# Altium project Argon_RevB_PCBA.PrjPcb (part 1 of 2)
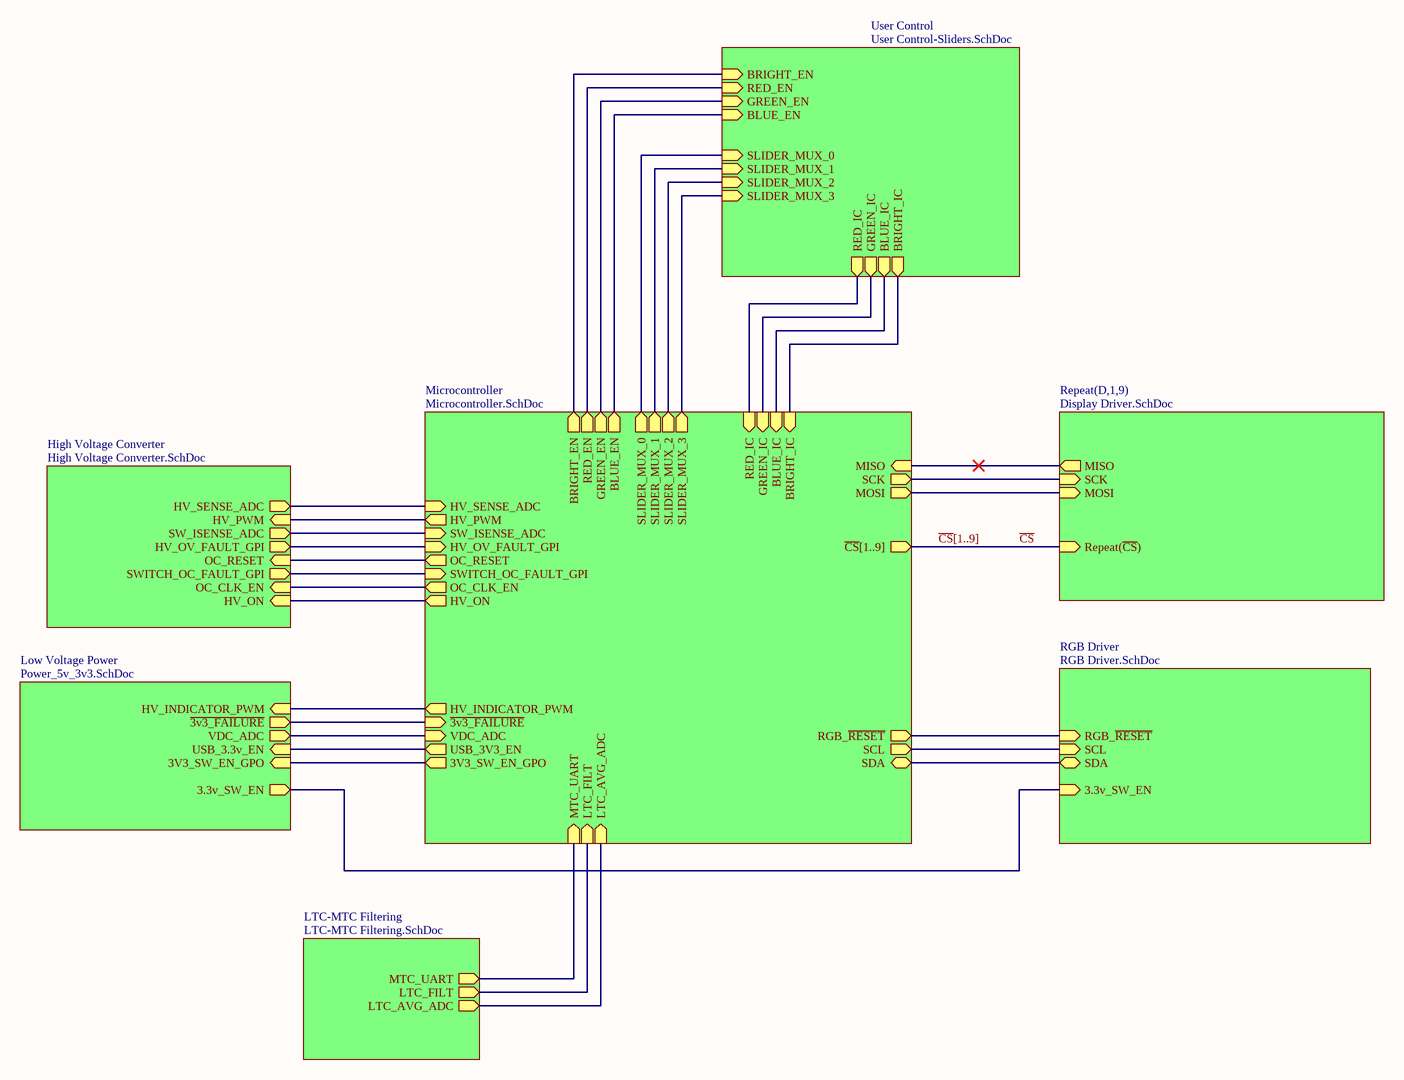
[diagram p0: Heirarchy.SchDoc]
8 sheets, 721 parts. Net scope: hierarchical (ports join the sheet entries above them; power ports are global).
Board file: Argon_RevB_PCB.PcbDoc
Sheets:
  Heirarchy.SchDoc
    Microcontroller = Microcontroller.SchDoc
    Low Voltage Power = Power_5v_3v3.SchDoc
    High Voltage Converter = High Voltage Converter.SchDoc
    D1 = Display Driver.SchDoc
    D2 = Display Driver.SchDoc
    D3 = Display Driver.SchDoc
    D4 = Display Driver.SchDoc
    D5 = Display Driver.SchDoc
    D6 = Display Driver.SchDoc
    D7 = Display Driver.SchDoc
    D8 = Display Driver.SchDoc
    D9 = Display Driver.SchDoc
    RGB Driver = RGB Driver.SchDoc
    LTC-MTC Filtering = LTC-MTC Filtering.SchDoc
    User Control = User Control-Sliders.SchDoc

## Sheet Heirarchy.SchDoc
size D

### Sub-sheets
High Voltage Converter = High Voltage Converter.SchDoc: HV_SENSE_ADC (out), HV_PWM (in), SW_ISENSE_ADC (out), HV_OV_FAULT_GPI (out), OC_RESET (in), SWITCH_OC_FAULT_GPI (out), OC_CLK_EN (in), HV_ON (in)
Low Voltage Power = Power_5v_3v3.SchDoc: HV_INDICATOR_PWM (in), ~{3v3_FAILURE} (out), VDC_ADC (out), USB_3.3v_EN (in), 3V3_SW_EN_GPO (in), 3.3v_SW_EN (out)
LTC-MTC Filtering = LTC-MTC Filtering.SchDoc: LTC_FILT (out), MTC_UART (out), LTC_AVG_ADC (out)
Microcontroller = Microcontroller.SchDoc: HV_PWM (out), SW_ISENSE_ADC (in), HV_INDICATOR_PWM (out), HV_OV_FAULT_GPI (in), VDC_ADC (in), HV_SENSE_ADC (in), ~{3v3_FAILURE} (in), ~{CS}[1..9] (out), USB_3V3_EN (out), RGB_~{RESET} (out), SCL (out), SDA (bidir), 3V3_SW_EN_GPO (out), MISO (in), MOSI (out), SCK (out), MTC_UART (in), LTC_FILT (in), LTC_AVG_ADC (in), BRIGHT_EN (out), RED_EN (out), BLUE_EN (out), GREEN_EN (out), SLIDER_MUX_0 (out), SLIDER_MUX_1 (out), SLIDER_MUX_2 (out), SLIDER_MUX_3 (out), RED_IC (in), BLUE_IC (in), BRIGHT_IC (in), GREEN_IC (in), OC_RESET (out), SWITCH_OC_FAULT_GPI (in), OC_CLK_EN (out), HV_ON (out)
Repeat(D,1,9) = Display Driver.SchDoc: Repeat(~{CS}) (in), MISO (out), SCK (in), MOSI (in)
RGB Driver = RGB Driver.SchDoc: RGB_~{RESET} (in), SCL (in), SDA (bidir), 3.3v_SW_EN (in)
User Control = User Control-Sliders.SchDoc: SLIDER_MUX_1 (in), BLUE_IC (out), BLUE_EN (in), GREEN_EN (in), BRIGHT_EN (in), SLIDER_MUX_0 (in), RED_EN (in), SLIDER_MUX_2 (in), SLIDER_MUX_3 (in), RED_IC (out), GREEN_IC (out), BRIGHT_IC (out)

### Nets
3.3v_SW_EN: sheet Low Voltage Power/3.3v_SW_EN, sheet RGB Driver/3.3v_SW_EN
~{CS}: sheet Repeat(D,1,9)/Repeat(~{CS})
HV_VSENSE_ADC: sheet Microcontroller/HV_SENSE_ADC, sheet High Voltage Converter/HV_SENSE_ADC
MISO: sheet Microcontroller/MISO, sheet Repeat(D,1,9)/MISO
MOSI: sheet Microcontroller/MOSI, sheet Repeat(D,1,9)/MOSI
RGB_~{RESET}: sheet Microcontroller/RGB_~{RESET}, sheet RGB Driver/RGB_~{RESET}
SCK: sheet Microcontroller/SCK, sheet Repeat(D,1,9)/SCK
SCL: sheet Microcontroller/SCL, sheet RGB Driver/SCL
SDA: sheet Microcontroller/SDA, sheet RGB Driver/SDA
SENSOR_MUX_0: sheet Microcontroller/SLIDER_MUX_0, sheet User Control/SLIDER_MUX_0
SENSOR_MUX_1: sheet Microcontroller/SLIDER_MUX_1, sheet User Control/SLIDER_MUX_1
SENSOR_MUX_2: sheet Microcontroller/SLIDER_MUX_2, sheet User Control/SLIDER_MUX_2
SENSOR_MUX_3: sheet Microcontroller/SLIDER_MUX_3, sheet User Control/SLIDER_MUX_3
SW_ISENSE_ADC: sheet Microcontroller/SW_ISENSE_ADC, sheet High Voltage Converter/SW_ISENSE_ADC
UV_SWITCH: sheet Microcontroller/~{3v3_FAILURE}, sheet Low Voltage Power/~{3v3_FAILURE}
NetC42_1: sheet Microcontroller/VDC_ADC, sheet Low Voltage Power/VDC_ADC
NetC76_1: sheet Microcontroller/MTC_UART, sheet LTC-MTC Filtering/MTC_UART
NetC77_1: sheet Microcontroller/LTC_AVG_ADC, sheet LTC-MTC Filtering/LTC_AVG_ADC
NetR8_1: sheet Microcontroller/HV_INDICATOR_PWM, sheet Low Voltage Power/HV_INDICATOR_PWM
NetR16_1: sheet Microcontroller/HV_PWM, sheet High Voltage Converter/HV_PWM
NetR38_1: sheet Microcontroller/USB_3V3_EN, sheet Low Voltage Power/USB_3.3v_EN
NetR76_1: sheet Microcontroller/3V3_SW_EN_GPO, sheet Low Voltage Power/3V3_SW_EN_GPO
NetR82_2: sheet Microcontroller/OC_CLK_EN, sheet High Voltage Converter/OC_CLK_EN
NetR106_2: sheet Microcontroller/OC_RESET, sheet High Voltage Converter/OC_RESET
NetR109_2: sheet Microcontroller/LTC_FILT, sheet LTC-MTC Filtering/LTC_FILT
NetR118_2: sheet Microcontroller/RED_IC, sheet User Control/RED_IC
NetR120_2: sheet Microcontroller/GREEN_IC, sheet User Control/GREEN_IC
NetR129_2: sheet Microcontroller/BLUE_IC, sheet User Control/BLUE_IC
NetR130_2: sheet Microcontroller/BRIGHT_IC, sheet User Control/BRIGHT_IC
NetR143_2: sheet Microcontroller/HV_OV_FAULT_GPI, sheet High Voltage Converter/HV_OV_FAULT_GPI
NetR154_2: sheet Microcontroller/SWITCH_OC_FAULT_GPI, sheet High Voltage Converter/SWITCH_OC_FAULT_GPI
NetR159_2: sheet Microcontroller/HV_ON, sheet High Voltage Converter/HV_ON
NetU1_84: sheet Microcontroller/GREEN_EN, sheet User Control/GREEN_EN
NetU1_85: sheet Microcontroller/RED_EN, sheet User Control/RED_EN
NetU1_86: sheet Microcontroller/BLUE_EN, sheet User Control/BLUE_EN
NetU1_87: sheet Microcontroller/BRIGHT_EN, sheet User Control/BRIGHT_EN

### Buses and harness runs
bus ~{CS}[1..9] = sheet Microcontroller/~{CS}[1..9]

## Sheet Microcontroller.SchDoc
size D
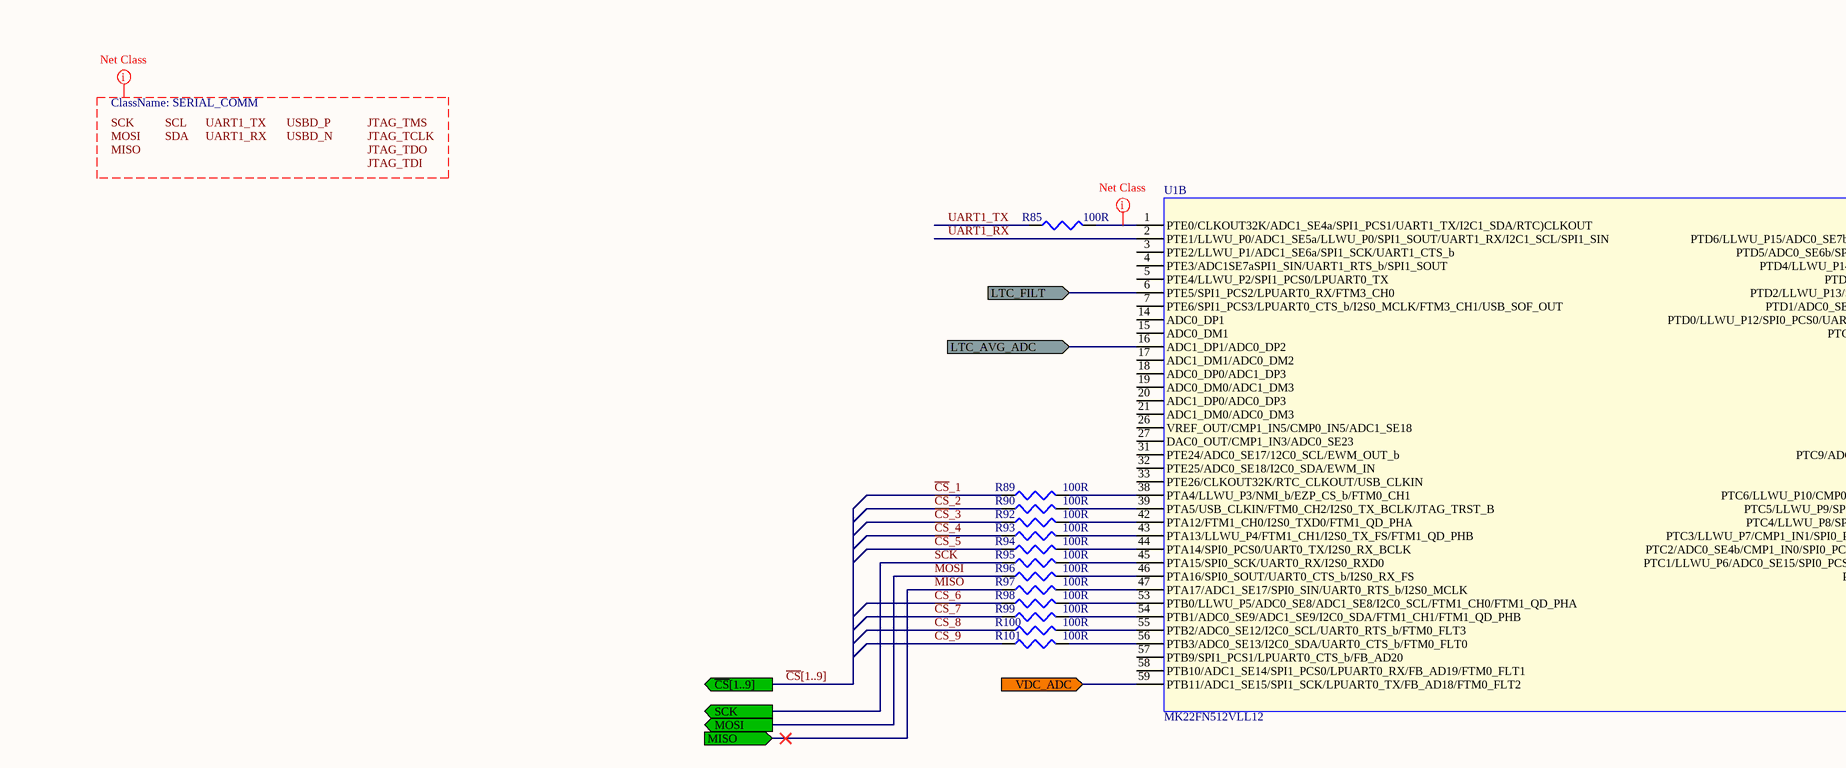
[diagram p1: Microcontroller.SchDoc, top left]
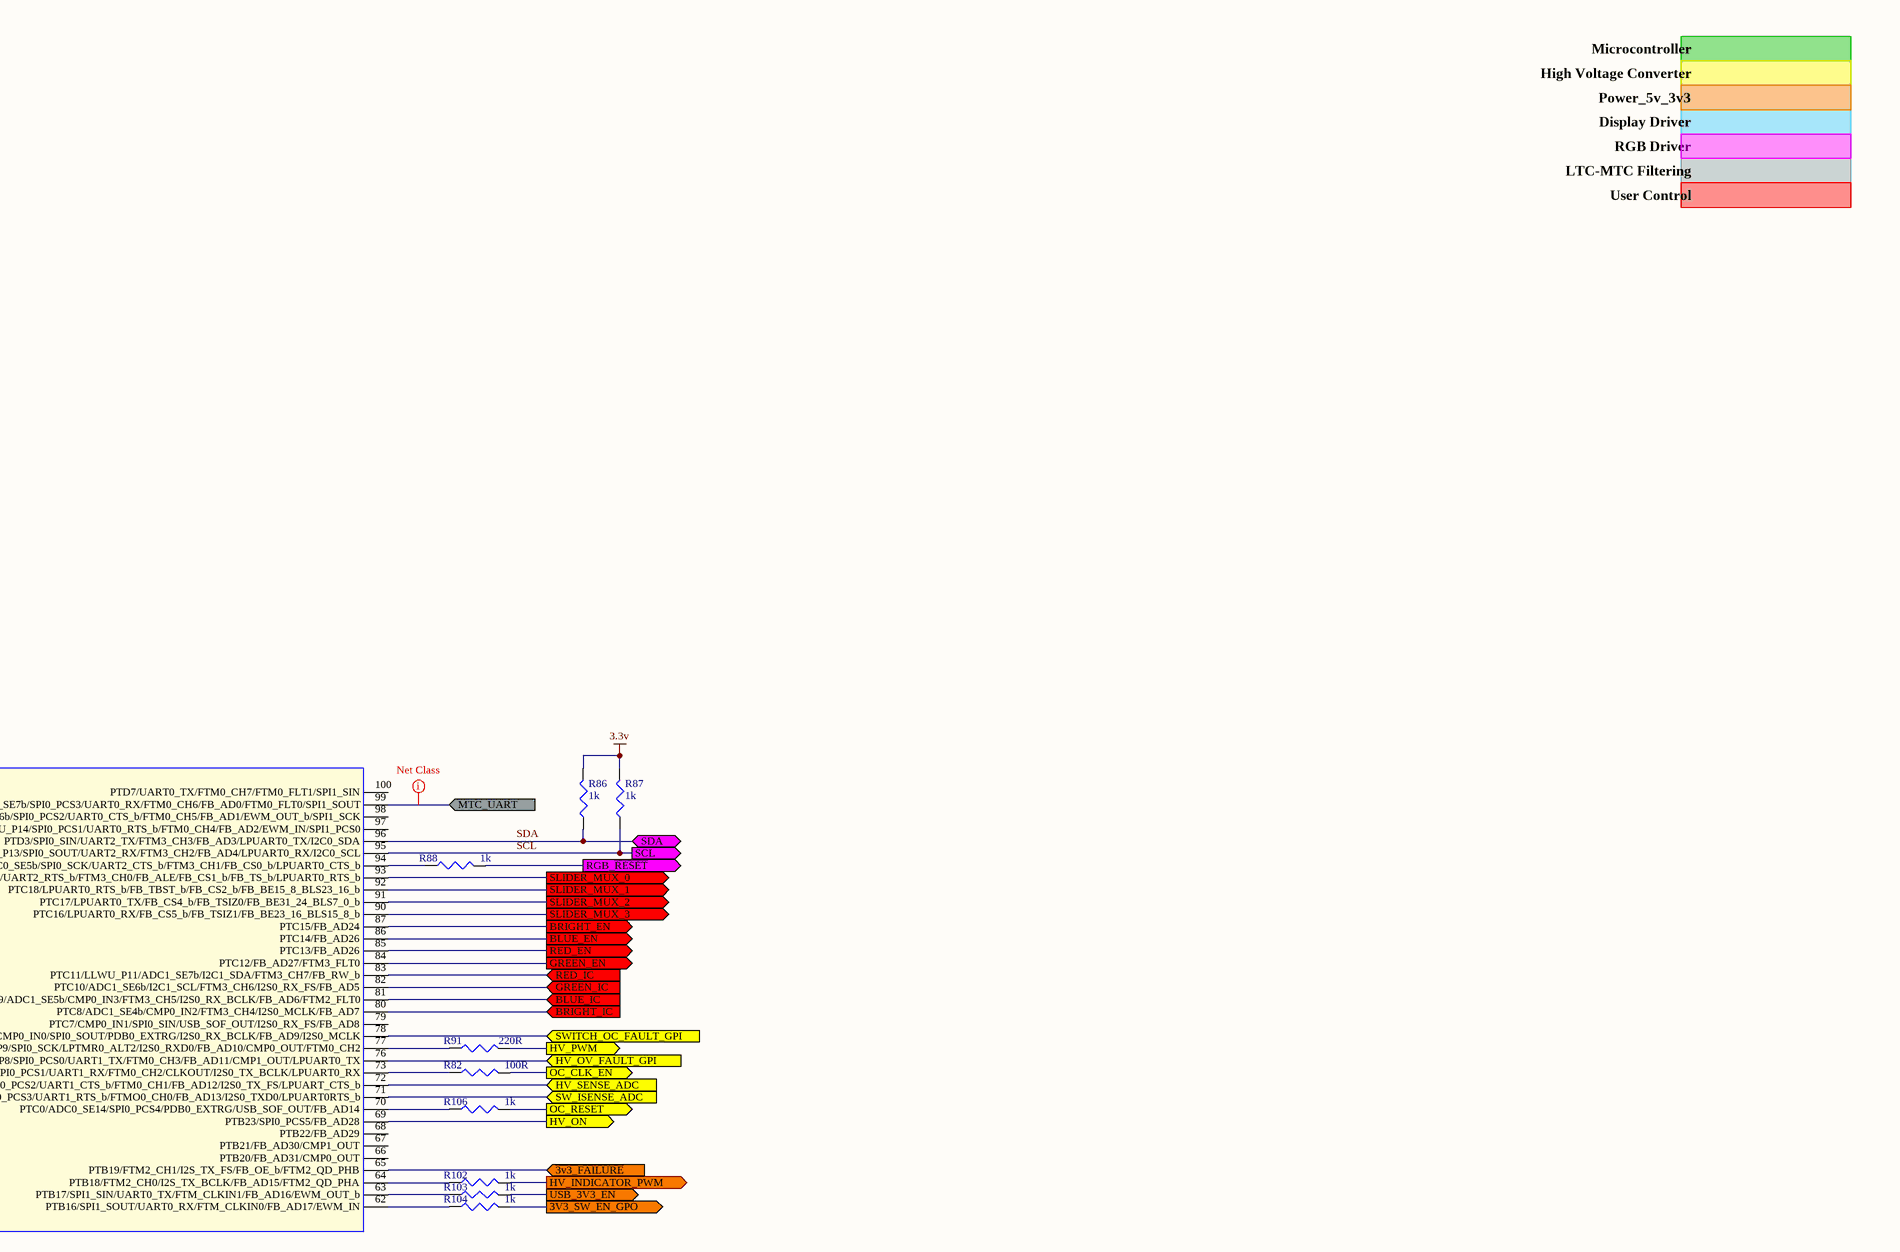
[diagram p2: Microcontroller.SchDoc, top right]
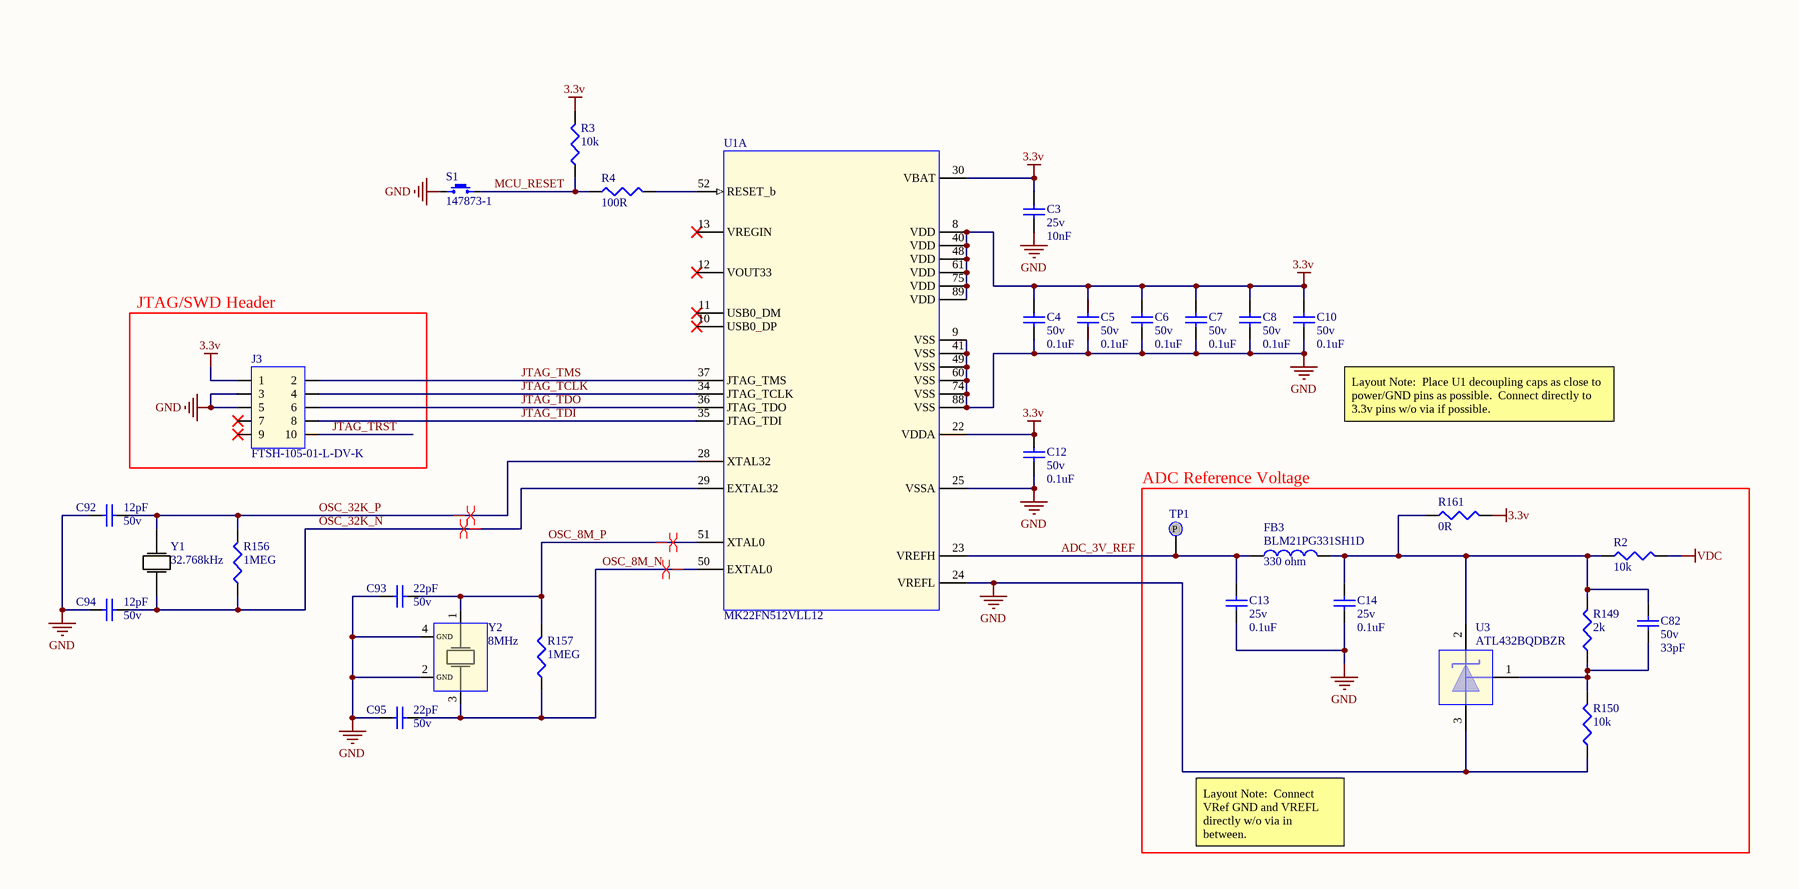
[diagram p3: Microcontroller.SchDoc, bottom left]
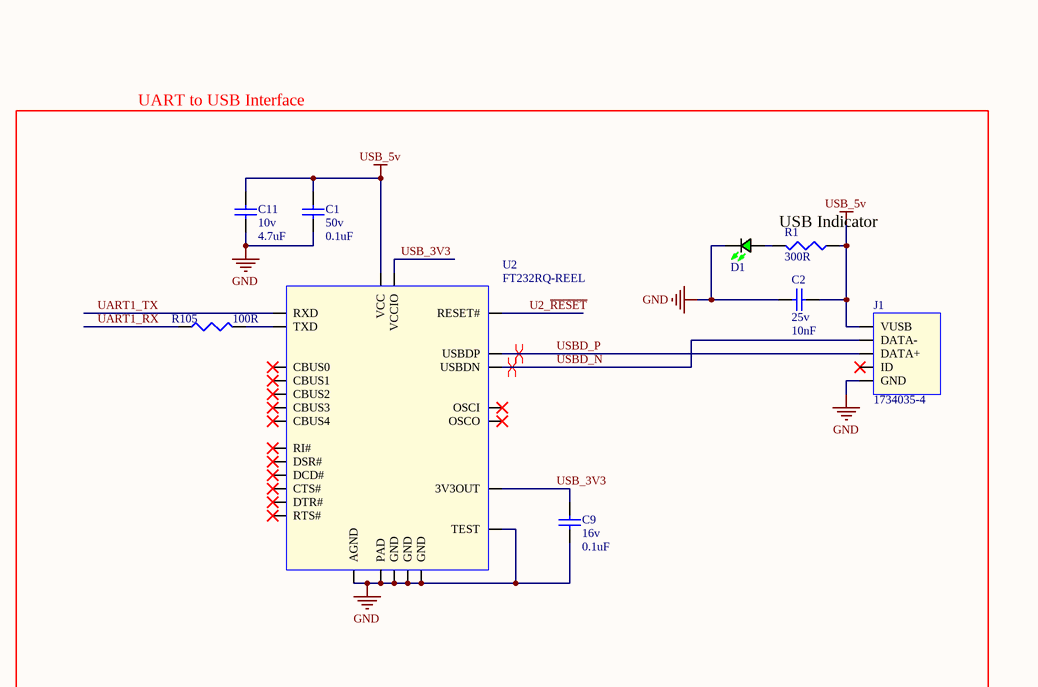
[diagram p4: Microcontroller.SchDoc, bottom right]

### Parts
C1  Voltage: 50v  [CAP0603R]  (hidden comment: 0.1uF)
C2  Voltage: 25v  [CAP0402R]  (hidden comment: 10nF)
C3  Voltage: 25v  [CAP0402R]  (hidden comment: 10nF)
C4  Voltage: 50v  [CAP0603R]  (hidden comment: 0.1uF)
C5  Voltage: 50v  [CAP0603R]  (hidden comment: 0.1uF)
C6  Voltage: 50v  [CAP0603R]  (hidden comment: 0.1uF)
C7  Voltage: 50v  [CAP0603R]  (hidden comment: 0.1uF)
C8  Voltage: 50v  [CAP0603R]  (hidden comment: 0.1uF)
C9  Voltage: 16v  [CAP0603R]  (hidden comment: 0.1uF)
C10  Voltage: 50v  [CAP0603R]  (hidden comment: 0.1uF)
C11  Voltage: 10v  [CAP0805R]  (hidden comment: 4.7uF)
C12  Voltage: 50v  [CAP0603R]  (hidden comment: 0.1uF)
C13  Voltage: 25v  [CAP0603R]  (hidden comment: 0.1uF)
C14  Voltage: 25v  [CAP0603R]  (hidden comment: 0.1uF)
C82  Voltage: 50v  [CAP0402R]  (hidden comment: 33pF)
C92  Voltage: 50v  [CAP0402R]  (hidden comment: 12pF)
C93  Voltage: 50v  [CAP0402R]  (hidden comment: 22pF)
C94  Voltage: 50v  [CAP0402R]  (hidden comment: 12pF)
C95  Voltage: 50v  [CAP0402R]  (hidden comment: 22pF)
D1  LTST-S270KGKT  [LED Green 0603]  (value not drawn)
FB3  BLM21PG331SH1D  IMPEDANCE: 330 ohm  [RES0805R]
J1  1734035-4  [USB MINI-B 1734035-4]
J3  FTSH-105-01-L-DV-K  [2x5 JTAG Header]
R1  300R  [RES0402R]
R2  10k  [RES0402R]
R3  10k  [RES0402R]
R4  100R  [RES0402R]
R82  100R  [RES0402R]
R85  100R  [RES0402R]
R86  1k  [RES0402R]
R87  1k  [RES0402R]
R88  1k  [RES0402R]
R89  100R  [RES0402R]
R90  100R  [RES0402R]
R91  220R  [RES0402R]
R92  100R  [RES0402R]
R93  100R  [RES0402R]
R94  100R  [RES0402R]
R95  100R  [RES0402R]
R96  100R  [RES0402R]
R97  100R  [RES0402R]
R98  100R  [RES0402R]
R99  100R  [RES0402R]
R100  100R  [RES0402R]
R101  100R  [RES0402R]
R102  1k  [RES0402R]
R103  1k  [RES0402R]
R104  1k  [RES0402R]
R105  100R  [RES0402R]
R106  1k  [RES0402R]
R149  2k  [RES0402R]
R150  10k  [RES0402R]
R156  1MEG  [RES0402R]
R157  1MEG  [RES0402R]
R161  0R  [RES0402R]
S1  147873-1  [TECONN_14783-1]
TP1  NONE  [TESTPOINT - 1.5mm Round Pad]  (value not drawn)
U1  MK22FN512VLL12  [LQFP100 0.5mm 14mmx14mm]  (parts A,B of 2)
U2  FT232RQ-REEL  [QFN32]
U3  ATL432BQDBZR  [SOT23-3M]
Y1  32.768kHz  [ABS07-32.768KHZ-T]
Y2  8MHz  [ABMM2-8.000MHZ-B2-T]

### Blocks framed on the sheet
JTAG/SWD Header: J3
ADC Reference Voltage: C13 C14 C82 FB3 R2 R149 R150 R161 TP1 U3

### Ports
3V3_SW_EN_GPO (out), BLUE_EN (out), BLUE_IC (in), BRIGHT_EN (out), BRIGHT_IC (in), GREEN_EN (out), GREEN_IC (in), HV_INDICATOR_PWM (out), HV_ON (out), HV_OV_FAULT_GPI (in), HV_PWM (out), HV_SENSE_ADC (in), LTC_AVG_ADC (in), LTC_FILT (in), MISO (in), MOSI (out), MTC_UART (in), OC_CLK_EN (out), OC_RESET (out), RED_EN (out), RED_IC (in), RGB_~{RESET} (out), SCK (out), SCL (out), SDA (bidir), SLIDER_MUX_0 (out), SLIDER_MUX_1 (out), SLIDER_MUX_2 (out), SLIDER_MUX_3 (out), SW_ISENSE_ADC (in), SWITCH_OC_FAULT_GPI (in), USB_3V3_EN (out), VDC_ADC (in), ~{3v3_FAILURE} (in), ~{CS}[1..9] (out)

### Nets
3.3v: C3.2 C4.1 C5.1 C6.1 C7.1 C8.1 C10.1 C12.1 J3.1 R3.2 R86.2 R87.2 R161.2 U1.8(VDD) U1.22(VDDA) U1.30(VBAT) U1.40(VDD) U1.48(VDD) U1.61(VDD) U1.75(VDD) U1.89(VDD)
GND: C1.2 C2.1 C3.1 C4.2 C5.2 C6.2 C7.2 C8.2 C9.1 C10.2 C11.2 C12.2 C13.2 C14.2 C92.2 C93.1 C94.2 C95.1 D1.1(K) J1.5(GND) J1.SH1 J1.SH2 J1.SH3 J1.SH4 J3.3 J3.5 R150.1 S1.1 U1.9(VSS) U1.24(VREFL) U1.25(VSSA) U1.41(VSS) U1.49(VSS) U1.60(VSS) U1.74(VSS) U1.88(VSS) U2.0(PAD) U2.4(GND) U2.17(GND) U2.20(GND) U2.24(AGND) U2.26(TEST) U3.3(A) Y2.2(GND) Y2.4(GND)
USB_5v: C1.1 C2.2 C11.1 J1.1(VUSB) R1.2 U2.19(VCC)
VDC: R2.2
ADC_3V_REF: C13.1 FB3.1 TP1.1 U1.23(VREFH)
~{CS}_1: R89.1
~{CS}_2: R90.1
~{CS}_3: R92.1
~{CS}_4: R93.1
~{CS}_5: R94.1
~{CS}_6: R98.1
~{CS}_7: R99.1
~{CS}_8: R100.1
~{CS}_9: R101.1
HV_VSENSE_ADC: U1.72(PTC2/ADC0_SE4b/CMP1_IN0/SPI0_PCS2/UART1_CTS_b/FTM0_CH1/FB_AD12/I2S0_TX_FS/LPUART_CTS_b) ; port HV_SENSE_ADC
JTAG_TCLK: J3.4 U1.34(JTAG_TCLK)
JTAG_TDI: J3.8 U1.35(JTAG_TDI)
JTAG_TDO: J3.6 U1.36(JTAG_TDO)
JTAG_TMS: J3.2 U1.37(JTAG_TMS)
JTAG_TRST: J3.10
MCU_RESET: R3.1 R4.1 S1.2
MISO: R97.1 ; port MISO
MOSI: R96.1 ; port MOSI
OSC_8M_N: C95.2 R157.1 U1.50(EXTAL0) Y2.3
OSC_8M_P: C93.2 R157.2 U1.51(XTAL0) Y2.1
OSC_32K_N: C94.1 R156.1 U1.29(EXTAL32) Y1.2
OSC_32K_P: C92.1 R156.2 U1.28(XTAL32) Y1.1
RGB_~{RESET}: R88.2 ; port RGB_~{RESET}
SCK: R95.1 ; port SCK
SCL: R87.1 U1.95(PTD2/LLWU_P13/SPI0_SOUT/UART2_RX/FTM3_CH2/FB_AD4/LPUART0_RX/I2C0_SCL) ; port SCL
SDA: R86.1 U1.96(PTD3/SPI0_SIN/UART2_TX/FTM3_CH3/FB_AD3/LPUART0_TX/I2C0_SDA) ; port SDA
SENSOR_MUX_0: U1.93(PTD0/LLWU_P12/SPI0_PCS0/UART2_RTS_b/FTM3_CH0/FB_ALE/FB_CS1_b/FB_TS_b/LPUART0_RTS_b) ; port SLIDER_MUX_0
SENSOR_MUX_1: U1.92(PTC18/LPUART0_RTS_b/FB_TBST_b/FB_CS2_b/FB_BE15_8_BLS23_16_b) ; port SLIDER_MUX_1
SENSOR_MUX_2: U1.91(PTC17/LPUART0_TX/FB_CS4_b/FB_TSIZ0/FB_BE31_24_BLS7_0_b) ; port SLIDER_MUX_2
SENSOR_MUX_3: U1.90(PTC16/LPUART0_RX/FB_CS5_b/FB_TSIZ1/FB_BE23_16_BLS15_8_b) ; port SLIDER_MUX_3
SW_ISENSE_ADC: U1.71(PTC1/LLWU_P6/ADC0_SE15/SPI0_PCS3/UART1_RTS_b/FTMO0_CH0/FB_AD13/I2S0_TXD0/LPUART0RTS_b) ; port SW_ISENSE_ADC
U2_~{RESET}: U2.18(RESET#)
UART1_RX: R105.1 U1.2(PTE1/LLWU_P0/ADC1_SE5a/LLWU_P0/SPI1_SOUT/UART1_RX/I2C1_SCL/SPI1_SIN)
UART1_TX: R85.1 U2.2(RXD)
USB_3V3: C9.2 U2.1(VCCIO) U2.16(3V3OUT)
USBD_N: J1.2(DATA-) U2.15(USBDN)
USBD_P: J1.3(DATA+) U2.14(USBDP)
UV_SWITCH: U1.65(PTB19/FTM2_CH1/I2S_TX_FS/FB_OE_b/FTM2_QD_PHB) ; port ~{3v3_FAILURE}
NetC14_1: C14.1 C82.1 FB3.2 R2.1 R149.2 R161.1 U3.2(K)
NetC42_1: U1.59(PTB11/ADC1_SE15/SPI1_SCK/LPUART0_TX/FB_AD18/FTM0_FLT2) ; port VDC_ADC
NetC76_1: U1.99(PTD6/LLWU_P15/ADC0_SE7b/SPI0_PCS3/UART0_RX/FTM0_CH6/FB_AD0/FTM0_FLT0/SPI1_SOUT) ; port MTC_UART
NetC77_1: U1.16(ADC1_DP1/ADC0_DP2) ; port LTC_AVG_ADC
NetC82_2: C82.2 R149.1 R150.2 U3.1(REF)
NetD1_2: D1.2(A) R1.1
NetR4_2: R4.2 U1.52(RESET_b)
NetR8_1: R102.2 ; port HV_INDICATOR_PWM
NetR16_1: R91.2 ; port HV_PWM
NetR38_1: R103.2 ; port USB_3V3_EN
NetR76_1: R104.2 ; port 3V3_SW_EN_GPO
NetR82_1: R82.1 U1.73(PTC3/LLWU_P7/CMP1_IN1/SPI0_PCS1/UART1_RX/FTM0_CH2/CLKOUT/I2S0_TX_BCLK/LPUART0_RX)
NetR82_2: R82.2 ; port OC_CLK_EN
NetR85_2: R85.2 U1.1(PTE0/CLKOUT32K/ADC1_SE4a/SPI1_PCS1/UART1_TX/I2C1_SDA/RTC)CLKOUT)
NetR88_1: R88.1 U1.94(PTD1/ADC0_SE5b/SPI0_SCK/UART2_CTS_b/FTM3_CH1/FB_CS0_b/LPUART0_CTS_b)
NetR89_2: R89.2 U1.38(PTA4/LLWU_P3/NMI_b/EZP_CS_b/FTM0_CH1)
NetR90_2: R90.2 U1.39(PTA5/USB_CLKIN/FTM0_CH2/I2S0_TX_BCLK/JTAG_TRST_B)
NetR91_1: R91.1 U1.77(PTC5/LLWU_P9/SPI0_SCK/LPTMR0_ALT2/I2S0_RXD0/FB_AD10/CMP0_OUT/FTM0_CH2)
NetR92_2: R92.2 U1.42(PTA12/FTM1_CH0/I2S0_TXD0/FTM1_QD_PHA)
NetR93_2: R93.2 U1.43(PTA13/LLWU_P4/FTM1_CH1/I2S0_TX_FS/FTM1_QD_PHB)
NetR94_2: R94.2 U1.44(PTA14/SPI0_PCS0/UART0_TX/I2S0_RX_BCLK)
NetR95_2: R95.2 U1.45(PTA15/SPI0_SCK/UART0_RX/I2S0_RXD0)
NetR96_2: R96.2 U1.46(PTA16/SPI0_SOUT/UART0_CTS_b/I2S0_RX_FS)
NetR97_2: R97.2 U1.47(PTA17/ADC1_SE17/SPI0_SIN/UART0_RTS_b/I2S0_MCLK)
NetR98_2: R98.2 U1.53(PTB0/LLWU_P5/ADC0_SE8/ADC1_SE8/I2C0_SCL/FTM1_CH0/FTM1_QD_PHA)
NetR99_2: R99.2 U1.54(PTB1/ADC0_SE9/ADC1_SE9/I2C0_SDA/FTM1_CH1/FTM1_QD_PHB)
NetR100_2: R100.2 U1.55(PTB2/ADC0_SE12/I2C0_SCL/UART0_RTS_b/FTM0_FLT3)
NetR101_2: R101.2 U1.56(PTB3/ADC0_SE13/I2C0_SDA/UART0_CTS_b/FTM0_FLT0)
NetR102_1: R102.1 U1.64(PTB18/FTM2_CH0/I2S_TX_BCLK/FB_AD15/FTM2_QD_PHA)
NetR103_1: R103.1 U1.63(PTB17/SPI1_SIN/UART0_TX/FTM_CLKIN1/FB_AD16/EWM_OUT_b)
NetR104_1: R104.1 U1.62(PTB16/SPI1_SOUT/UART0_RX/FTM_CLKIN0/FB_AD17/EWM_IN)
NetR105_2: R105.2 U2.30(TXD)
NetR106_1: R106.1 U1.70(PTC0/ADC0_SE14/SPI0_PCS4/PDB0_EXTRG/USB_SOF_OUT/FB_AD14)
NetR106_2: R106.2 ; port OC_RESET
NetR109_2: U1.6(PTE5/SPI1_PCS2/LPUART0_RX/FTM3_CH0) ; port LTC_FILT
NetR118_2: U1.83(PTC11/LLWU_P11/ADC1_SE7b/I2C1_SDA/FTM3_CH7/FB_RW_b) ; port RED_IC
NetR120_2: U1.82(PTC10/ADC1_SE6b/I2C1_SCL/FTM3_CH6/I2S0_RX_FS/FB_AD5) ; port GREEN_IC
NetR129_2: U1.81(PTC9/ADC1_SE5b/CMP0_IN3/FTM3_CH5/I2S0_RX_BCLK/FB_AD6/FTM2_FLT0) ; port BLUE_IC
NetR130_2: U1.80(PTC8/ADC1_SE4b/CMP0_IN2/FTM3_CH4/I2S0_MCLK/FB_AD7) ; port BRIGHT_IC
NetR143_2: U1.76(PTC4/LLWU_P8/SPI0_PCS0/UART1_TX/FTM0_CH3/FB_AD11/CMP1_OUT/LPUART0_TX) ; port HV_OV_FAULT_GPI
NetR154_2: U1.78(PTC6/LLWU_P10/CMP0_IN0/SPI0_SOUT/PDB0_EXTRG/I2S0_RX_BCLK/FB_AD9/I2S0_MCLK) ; port SWITCH_OC_FAULT_GPI
NetR159_2: U1.69(PTB23/SPI0_PCS5/FB_AD28) ; port HV_ON
NetU1_84: U1.84(PTC12/FB_AD27/FTM3_FLT0) ; port GREEN_EN
NetU1_85: U1.85(PTC13/FB_AD26) ; port RED_EN
NetU1_86: U1.86(PTC14/FB_AD26) ; port BLUE_EN
NetU1_87: U1.87(PTC15/FB_AD24) ; port BRIGHT_EN

Not connected (* = marked no-connect by the designer): J1 4(ID)*; J3 7* 9*; U1 3(PTE2/LLWU_P1/ADC1_SE6a/SPI1_SCK/UART1_CTS_b) 4(PTE3/ADC1SE7aSPI1_SIN/UART1_RTS_b/SPI1_SOUT) 5(PTE4/LLWU_P2/SPI1_PCS0/LPUART0_TX) 7(PTE6/SPI1_PCS3/LPUART0_CTS_b/I2S0_MCLK/FTM3_CH1/USB_SOF_OUT) 10(USB0_DP)* 11(USB0_DM)* 12(VOUT33)* 13(VREGIN)* 14(ADC0_DP1) 15(ADC0_DM1) 17(ADC1_DM1/ADC0_DM2) 18(ADC0_DP0/ADC1_DP3) 19(ADC0_DM0/ADC1_DM3) 20(ADC1_DP0/ADC0_DP3) 21(ADC1_DM0/ADC0_DM3) 26(VREF_OUT/CMP1_IN5/CMP0_IN5/ADC1_SE18) 27(DAC0_OUT/CMP1_IN3/ADC0_SE23) 31(PTE24/ADC0_SE17/12C0_SCL/EWM_OUT_b) 32(PTE25/ADC0_SE18/I2C0_SDA/EWM_IN) 33(PTE26/CLKOUT32K/RTC_CLKOUT/USB_CLKIN) 57(PTB9/SPI1_PCS1/LPUART0_CTS_b/FB_AD20) 58(PTB10/ADC1_SE14/SPI1_PCS0/LPUART0_RX/FB_AD19/FTM0_FLT1) 66(PTB20/FB_AD31/CMP0_OUT) 67(PTB21/FB_AD30/CMP1_OUT) 68(PTB22/FB_AD29) 79(PTC7/CMP0_IN1/SPI0_SIN/USB_SOF_OUT/I2S0_RX_FS/FB_AD8) 97(PTD4/LLWU_P14/SPI0_PCS1/UART0_RTS_b/FTM0_CH4/FB_AD2/EWM_IN/SPI1_PCS0) 98(PTD5/ADC0_SE6b/SPI0_PCS2/UART0_CTS_b/FTM0_CH5/FB_AD1/EWM_OUT_b/SPI1_SCK) 100(PTD7/UART0_TX/FTM0_CH7/FTM0_FLT1/SPI1_SIN); U2 3(RI#)* 5(NC) 6(DSR#)* 7(DCD#)* 8(CTS#)* 9(CBUS4)* 10(CBUS2)* 11(CBUS3)* 12(NC) 13(NC) 21(CBUS1)* 22(CBUS0)* 23(NC) 25(NC) 27(OSCI)* 28(OSCO)* 29(NC) 31(DTR#)* 32(RTS#)*

### Buses and harness runs
bus ~{CS}[1..9] = port ~{CS}[1..9]

### Layout directives
differential pair: OSC_8M_N, OSC_8M_P, OSC_32K_N, OSC_32K_P, USBD_N, USBD_P
net class SERIAL_COMM: JTAG_TCLK, JTAG_TDI, JTAG_TDO, JTAG_TMS, MISO, MOSI, NetC76_1, NetR85_2, SCK, SCL, SDA, UART1_RX, UART1_TX, USBD_N, USBD_P

### Notes on the sheet
- Microcontroller
- High Voltage Converter
- Display Driver
- Power_5v_3v3
- RGB Driver
- LTC-MTC Filtering
- User Control
- UART to USB Interface
- USB Indicator
- Layout Note:  Place U1 decoupling caps as close to power/GND pins as possible.  Connect directly to 3.3v pins w/o via if possible.
- Layout Note:  Connect VRef GND and VREFL directly w/o via in between.
- Labels drawn without touching a wire or pin: JTAG_TCLK, JTAG_TDI, JTAG_TDO, JTAG_TMS, MISO, MOSI, SCK, SCL, SDA, UART1_RX, UART1_TX, USBD_N, USBD_P
- (in symbol Testpoint 1.5mm Pad) P

### Library data of the parts
C1 C4-C8 C10 C12 = 0.1uF 50v (0603): MFG_PN: VJ0603V104ZXAPW1BC; MFG: Vishay; LOAD: NL; Value: 0.1uF
C2 C3 = 10nF 25v (0402): Tolerance: 5%; MFG_PN: VJ0402Y103JXXAC; MFG: Vishay; LOAD: NL; Value: 10nF
C9 = 0.1uF 16v (0603): MFG_PN: VJ0603Y104JXJPW1BC; MFG: Vishay; LOAD: NL; Value: 0.1uF
C11 = 4.7uF 10v (0805): MFG_PN: VJ0805V475MXQTW1BC; MFG: Vishay; LOAD: NL; Value: 4.7uF
C13 C14 = 0.1uF 25v (0603): MFG_PN: VJ0603Y104KXXCW1BC; MFG: Vishay; LOAD: NL; TEMP_MAX: 125C; Value: 0.1uF
C82 = 33pF 50v (0402): Tolerance: 5%; MFG_PN: VJ0402A330JXACW1BC; MFG: Vishay; LOAD: NL; Value: 33pF
C92 C94 = 12pF 50v (0402): Tolerance: 5%; MFG_PN: GRM1555C1H120JA01D; MFG: Murata; LOAD: NL; Value: 12pF
C93 C95 = 22pF 50v (0402): Tolerance: 5%; MFG_PN: 04025A220JAT2A; MFG: AVX; LOAD: NL; Value: 22pF
D1 = LED Green 0603: MFG: Lite On; VFORWARD: 2v; CURRENT: 20mA; COLOR: Green; MFG_PN: LTST-S270KGKT
FB3 = BLM21PG331SH1D (0805): MFG: MURATA; CURRENT: 3A; LOAD: NL; TOLERANCE: 20%; MFG_PN: BLM21PG331SH1D
J1 = USB Mini-B Female: USB Mini B Female; MFG: TE CONNECTIVITY; CONTACTS: 5; LOAD: NL; MFG_PN: 1734035-4; TYPE: USB Mini B; GENDER: FEMALE
J3 = 2x5 JTAG Header SMD Shrouded: 2x5 JTAG Header SMD Shrouded (1.27mm); LOAD: NL; MFG: SAMTEC; CURRENT: 1A; MFG_PN: FTSH-105-01-L-DV-K
R1 = 300R (0402): Tolerance: 1%; POWER: 63mW; MFG_PN: CRCW0402300RFKED; MFG: Vishay; Load: NL; Value: 300R
R2 R3 R150 = 10k (0402): Tolerance: 1%; POWER: 63mW; MFG_PN: CRCW040210K0FKED; MFG: Vishay; Load: NL; Value: 10k
R4 R82 R85 R89 R90 R92-R101 R105 = 100R (0402): Tolerance: 1%; POWER: 63mW; MFG_PN: CRCW0402100RFKED; MFG: Vishay; Load: NL; Value: 100R
R86-R88 R102-R104 R106 = 1k (0402): Tolerance: 1%; POWER: 63mW; MFG_PN: CRCW04021K00FKED; MFG: Vishay; Load: NL; Value: 1k
R91 = 220R (0402): Tolerance: 1%; POWER: 63mW; MFG_PN: CRCW0402220RFKED; MFG: Vishay; Load: NL; Value: 220R
R149 = 2k (0402): Tolerance: 1%; POWER: 63mW; MFG_PN: CRCW04022K00FKED; MFG: Vishay; Load: NL; Value: 2k
R156 R157 = 1MEG (0402): Tolerance: 1%; POWER: 63mW; MFG_PN: CRCW04021M00FKED; MFG: Vishay; Load: NL; Value: 1MEG
R161 = 0R (0402): MFG_PN: CRCW04020000Z0ED; MFG: Vishay; Load: NL; Value: 0R
S1 = SPST Momentary Micro: Micro SPST Momentary Switch; MFG: TE CONNECTIVITY; LOAD: NL; CURRENT: 50mA; VOLTAGE: 24v; MFG_PN: 147873-1
TP1 = Testpoint 1.5mm Pad: 1.5mm Testpoint
U1 = MK22FN512VLL12: 32-bit ARM Cortex-M4 Microcontroller; MFG: FREESCALE; MFG_PN: MK22FN512VLL12
U2 = FT232RQ-REEL: UART Interface/Bridge; MFG: FTDI; MFG_PN: FT232RQ-REEL
U3 = ATL432BQDBZR: Shunt Voltage Reference, 0.5%; MFG: TI; VREF: 2.500v; MFG_PN: ATL432BQDBZR
Y1 = 32kHz Crystal: MFG: ABRACON; CLOAD: 12.5pF; FREQ: 32.768kHz; MFG_PN: ABS07-32.768KHZ-T
Y2 = 8.0MHz Crystal 18pF 20ppm: 8.0MHz Crystal; MFG: ABRACON; CLOAD: 18pF; MFG_PN: ABM3B-8.000MHZ-B2-T; FREQ: 8MHz

## Sheet Power_5v_3v3.SchDoc
size C
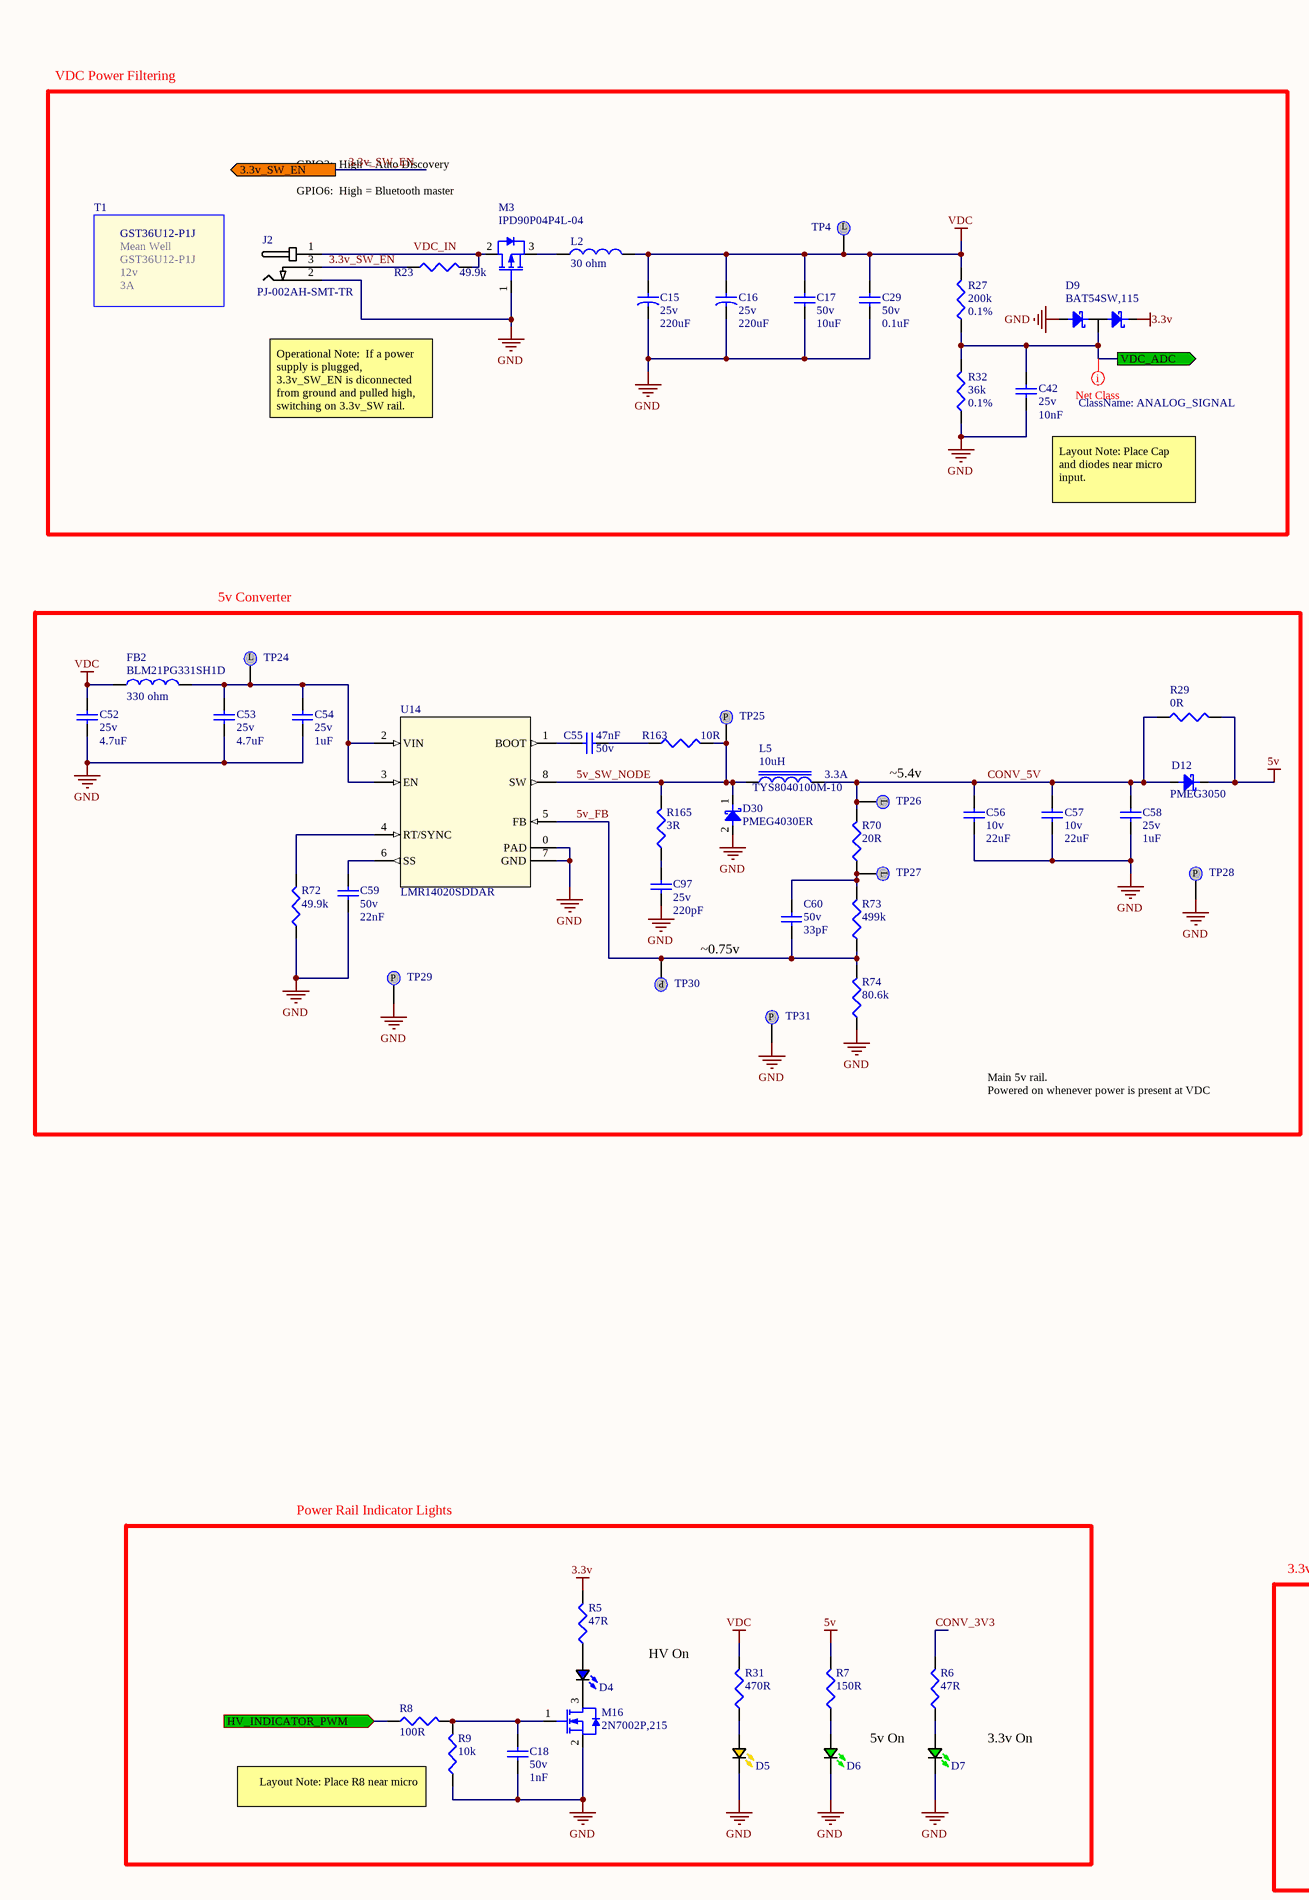
[diagram p5: Power_5v_3v3.SchDoc, left]
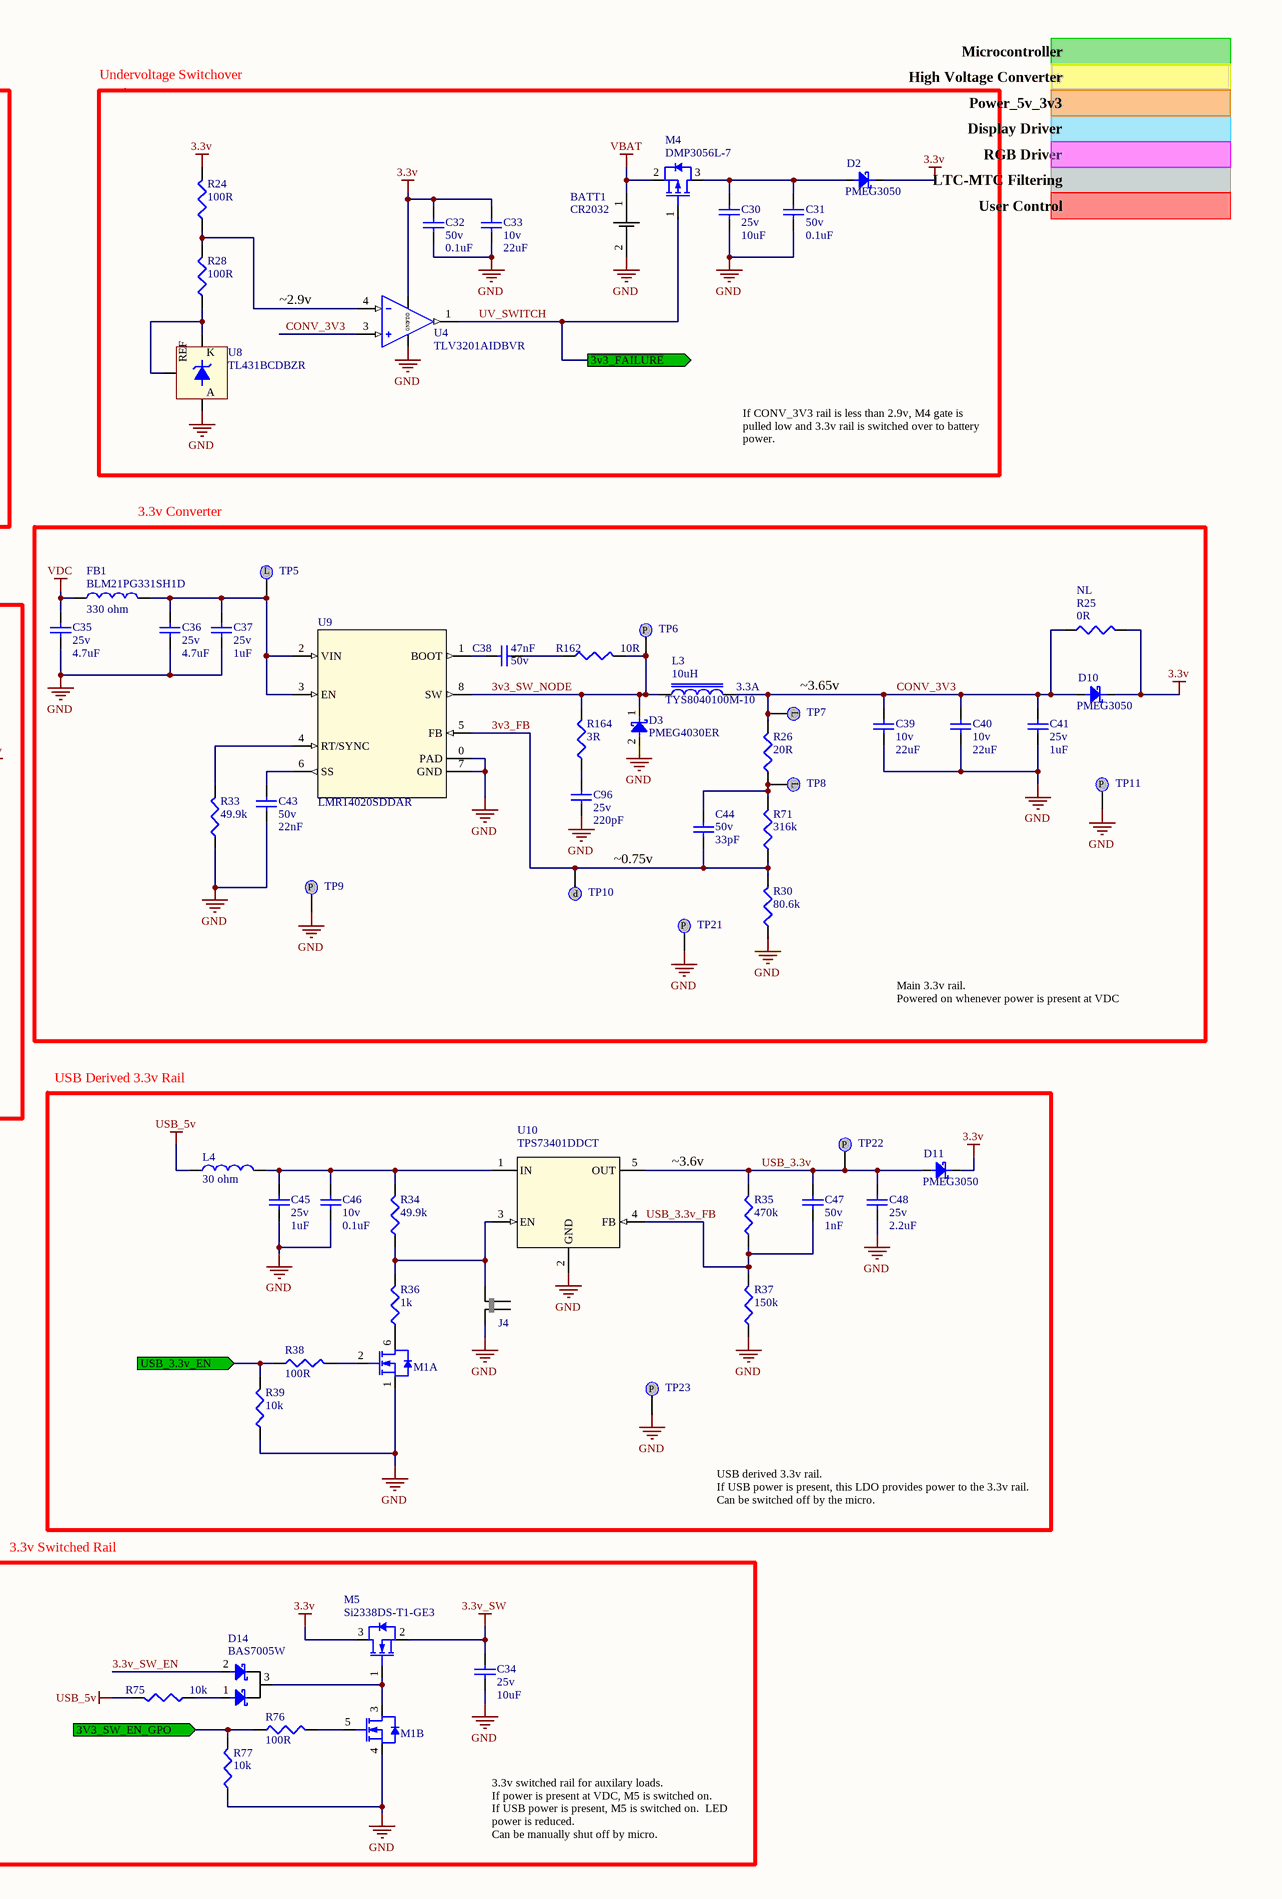
[diagram p6: Power_5v_3v3.SchDoc, right]

### Parts
BATT1  CR2032  [2032 Holder]
C15  Voltage: 25v  [SMD ELEC CAP (D=6.3, L=7.7, H=8)]  (hidden comment: 220uF)
C16  Voltage: 25v  [SMD ELEC CAP (D=6.3, L=7.7, H=8)]  (hidden comment: 220uF)
C17  Voltage: 50v  [CAP1206R]  (hidden comment: 10uF)
C18  Voltage: 50v  [CAP0402R]  (hidden comment: 1nF)
C29  Voltage: 50v  [CAP0603R]  (hidden comment: 0.1uF)
C30  Voltage: 25v  [CAP1206R]  (hidden comment: 10uF)
C31  Voltage: 50v  [CAP0603R]  (hidden comment: 0.1uF)
C32  Voltage: 50v  [CAP0603R]  (hidden comment: 0.1uF)
C33  Voltage: 10v  [CAP1210R]  (hidden comment: 22uF)
C34  Voltage: 25v  [CAP1206R]  (hidden comment: 10uF)
C35  Voltage: 25v  [CAP1206R]  (hidden comment: 4.7uF)
C36  Voltage: 25v  [CAP1206R]  (hidden comment: 4.7uF)
C37  Voltage: 25v  [CAP0805R]  (hidden comment: 1uF)
C38  Voltage: 50v  [CAP0603R]  (hidden comment: 47nF)
C39  Voltage: 10v  [CAP1210R]  (hidden comment: 22uF)
C40  Voltage: 10v  [CAP1210R]  (hidden comment: 22uF)
C41  Voltage: 25v  [CAP0805R]  (hidden comment: 1uF)
C42  Voltage: 25v  [CAP0402R]  (hidden comment: 10nF)
C43  Voltage: 50v  [CAP0603R]  (hidden comment: 22nF)
C44  Voltage: 50v  [CAP0402R]  (hidden comment: 33pF)
C45  Voltage: 25v  [CAP0805R]  (hidden comment: 1uF)
C46  Voltage: 10v  [CAP0402R]  (hidden comment: 0.1uF)
C47  Voltage: 50v  [CAP0402R]  (hidden comment: 1nF)
C48  Voltage: 25v  [CAP1206R]  (hidden comment: 2.2uF)
C52  Voltage: 25v  [CAP1206R]  (hidden comment: 4.7uF)
C53  Voltage: 25v  [CAP1206R]  (hidden comment: 4.7uF)
C54  Voltage: 25v  [CAP0805R]  (hidden comment: 1uF)
C55  Voltage: 50v  [CAP0603R]  (hidden comment: 47nF)
C56  Voltage: 10v  [CAP1210R]  (hidden comment: 22uF)
C57  Voltage: 10v  [CAP1210R]  (hidden comment: 22uF)
C58  Voltage: 25v  [CAP0805R]  (hidden comment: 1uF)
C59  Voltage: 50v  [CAP0603R]  (hidden comment: 22nF)
C60  Voltage: 50v  [CAP0402R]  (hidden comment: 33pF)
C96  Voltage: 25v  [CAP0402R]  (hidden comment: 220pF)
C97  Voltage: 25v  [CAP0402R]  (hidden comment: 220pF)
D2  PMEG3050  [SOD128]
D3  PMEG4030ER  [SOD-123]
D4  LTST-C193TBKT-5A  [LED Blue 0603]  (value not drawn)
D5  LTST-C190AKT  [LED Amber 0603]  (value not drawn)
D6  LTST-S270KGKT  [LED Green 0603]  (value not drawn)
D7  LTST-S270KGKT  [LED Green 0603]  (value not drawn)
D9  BAT54SW,115  [SOT-323]
D10  PMEG3050  [SOD128]
D11  PMEG3050  [SOD128]
D12  PMEG3050  [SOD128]
D14  BAS7005W  [SOT-323]
D30  PMEG4030ER  [SOD-123]
FB1  BLM21PG331SH1D  IMPEDANCE: 330 ohm  [RES0805R]
FB2  BLM21PG331SH1D  IMPEDANCE: 330 ohm  [RES0805R]
J2  PJ-002AH-SMT-TR  [PJ-002AH-SMT-TR]
J4  None  [Jumper_2.54mm_2x1]  (value not drawn)
L2  30 ohm  [RES0805R]
L3  10uH  CURRENT: 3.3A  [TYS8040100M-10]
L4  30 ohm  [RES0805R]
L5  10uH  CURRENT: 3.3A  [TYS8040100M-10]
M1  NX3020NAKV,115  [SOT666-6N]  (value not drawn)  (parts A,B of 2)
M3  IPD90P04P4L-04  [DPAK2]
M4  DMP3056L-7  [SOT23-3M]
M5  Si2338DS-T1-GE3  [SOT23-3M]
M16  2N7002P,215  [SOT23-3M]
R5  47R  [RES0603R]
R6  47R  [RES0603R]
R7  150R  [RES0603R]
R8  100R  [RES0402R]
R9  10k  [RES0402R]
R23  49.9k  [RES0402R]
R24  100R  [RES0402R]
R25  Load: NL  [RES1206R]  (hidden comment: 0R)
R26  20R  [RES0402R]
R27  Tolerance: 0.1%  [RES0402R]  (hidden comment: 200k)
R28  100R  [RES0402R]
R29  0R  [RES1206R]
R30  80.6k  [RES0402R]
R31  470R  [RES0603R]
R32  Tolerance: 0.1%  [RES0402R]  (hidden comment: 36k)
R33  49.9k  [RES0402R]
R34  49.9k  [RES0402R]
R35  470k  [RES0402R]
R36  1k  [RES0402R]
R37  150k  [RES0402R]
R38  100R  [RES0402R]
R39  10k  [RES0402R]
R70  20R  [RES0402R]
R71  316k  [RES0402R]
R72  49.9k  [RES0402R]
R73  499k  [RES0402R]
R74  80.6k  [RES0402R]
R75  10k  [RES0402R]
R76  100R  [RES0402R]
R77  10k  [RES0402R]
R162  10R  [RES0402R]
R163  10R  [RES0402R]
R164  3R  [RES0603R]
R165  3R  [RES0603R]
T1  GST36U12-P1J  MFG: Mean Well  VOUT: 12v  CURRENT: 3A  (mechanical)
TP4  5001  [5001 Testpoint]  (value not drawn)
TP5  5001  [5001 Testpoint]  (value not drawn)
TP6  NONE  [TESTPOINT - 1.5mm Round Pad]  (value not drawn)
TP7  5001  [5001 Testpoint]  (value not drawn)
TP8  5001  [5001 Testpoint]  (value not drawn)
TP9  NONE  [TESTPOINT - 1.5mm Round Pad]  (value not drawn)
TP10  NONE  [TESTPOINT - 1.5mm Round Pad]  (value not drawn)
TP11  NONE  [TESTPOINT - 1.5mm Round Pad]  (value not drawn)
TP21  NONE  [TESTPOINT - 1.5mm Round Pad]  (value not drawn)
TP22  NONE  [TESTPOINT - 1.5mm Round Pad]  (value not drawn)
TP23  NONE  [TESTPOINT - 1.5mm Round Pad]  (value not drawn)
TP24  5001  [5001 Testpoint]  (value not drawn)
TP25  NONE  [TESTPOINT - 1.5mm Round Pad]  (value not drawn)
TP26  5001  [5001 Testpoint]  (value not drawn)
TP27  5001  [5001 Testpoint]  (value not drawn)
TP28  NONE  [TESTPOINT - 1.5mm Round Pad]  (value not drawn)
TP29  NONE  [TESTPOINT - 1.5mm Round Pad]  (value not drawn)
TP30  NONE  [TESTPOINT - 1.5mm Round Pad]  (value not drawn)
TP31  NONE  [TESTPOINT - 1.5mm Round Pad]  (value not drawn)
U4  TLV3201AIDBVR  [SOT23-5]
U8  TL431BCDBZR  [SOT23-3M]
U9  LMR14020SDDAR  [HSOIC-8]
U10  TPS73401DDCT  [SOT23-5]
U14  LMR14020SDDAR  [HSOIC-8]

### Blocks framed on the sheet
VDC Power Filtering: C15-C17 C29 C42 D9 J2 L2 M3 R23 R27 R32 T1 TP4
3.3v Switched Rail: C34 D14 M1 M5 R75-R77

### Ports
3.3v_SW_EN (out), 3V3_SW_EN_GPO (in), HV_INDICATOR_PWM (in), USB_3.3v_EN (in), VDC_ADC (out), ~{3v3_FAILURE} (out)

### Nets
3.3v: C32.1 C33.1 D2.1(K) D9.2(A) D10.1(K) D11.1(K) M5.3(DRAIN) R5.2 R24.2 R25.2 U4.5(VDD)
3.3v_SW: C34.1 M5.2(SOURCE)
5v: D12.1(K) R7.2 R29.2
GND: BATT1.2 C15.1 C16.1 C17.2 C18.2 C29.2 C30.2 C31.2 C32.2 C33.2 C34.2 C35.2 C36.2 C37.2 C39.2 C40.2 C41.2 C42.2 C43.2 C45.2 C46.2 C48.2 C52.2 C53.2 C54.2 C56.2 C57.2 C58.2 C59.2 C96.2 C97.2 D3.2(A) D5.1(K) D6.1(K) D7.1(K) D9.1(A) D30.2(A) J2.2(RING) J4.1 M1.1(S1) M1.4(S2) M3.1(GATE) M16.2(SOURCE) R9.1 R30.1 R32.1 R33.1 R37.1 R39.1 R72.1 R74.1 R77.1 TP9.1 TP11.1 TP21.1 TP23.1 TP28.1 TP29.1 TP31.1 U4.2(GND) U8.3(A) U9.0(PAD) U9.7(GND) U10.2(GND) U14.0(PAD) U14.7(GND)
USB_5v: L4.1 R75.2
VBAT: BATT1.1 M4.2(DRAIN)
VDC: C15.2 C16.2 C17.1 C29.1 C35.1 C52.1 FB1.1 FB2.1 L2.2 R27.2 R31.2 TP4.1
3.3v_SW_EN: D14.2(A2) J2.3(SWITCH) R23.1 ; port 3.3v_SW_EN
3v3_FB: C44.2 R30.2 R71.1 TP10.1 U9.5(FB)
3v3_SW_NODE: D3.1(K) L3.1 R162.2 R164.2 TP6.1 U9.8(SW)
5v_FB: C60.2 R73.1 R74.2 TP30.1 U14.5(FB)
5v_SW_NODE: D30.1(K) L5.1 R163.2 R165.2 TP25.1 U14.8(SW)
CONV_3V3: C39.1 C40.1 C41.1 D10.2(A) L3.2 R6.2 R25.1 R26.2 TP7.1 U4.3(+)
CONV_5V: C56.1 C57.1 C58.1 D12.2(A) L5.2 R29.1 R70.2 TP26.1
USB_3.3v: C47.1 C48.1 D11.2(A) R35.2 TP22.1 U10.5(OUT)
USB_3.3v_FB: C47.2 R35.1 R37.2 U10.4(FB)
UV_SWITCH: M4.1(GATE) U4.1(OUT) ; port ~{3v3_FAILURE}
VDC_IN: J2.1(PIN) M3.2(DRAIN) R23.2
NetC18_1: C18.1 M16.1(GATE) R8.2 R9.2
NetC30_1: C30.1 C31.1 D2.2(A) M4.3(SOURCE)
NetC36_1: C36.1 C37.1 FB1.2 TP5.1 U9.2(VIN) U9.3(EN)
NetC38_1: C38.1 U9.1(BOOT)
NetC38_2: C38.2 R162.1
NetC42_1: C42.1 D9.3(AK) R27.1 R32.2 ; port VDC_ADC
NetC43_1: C43.1 U9.6(SS)
NetC44_1: C44.1 R26.1 R71.2 TP8.1
NetC45_1: C45.1 C46.1 L4.2 R34.2 U10.1(IN)
NetC53_1: C53.1 C54.1 FB2.2 TP24.1 U14.2(VIN) U14.3(EN)
NetC55_1: C55.1 U14.1(BOOT)
NetC55_2: C55.2 R163.1
NetC59_1: C59.1 U14.6(SS)
NetC60_1: C60.1 R70.1 R73.2 TP27.1
NetC96_1: C96.1 R164.1
NetC97_1: C97.1 R165.1
NetD4_1: D4.1(K) M16.3(DRAIN)
NetD4_2: D4.2(A) R5.1
NetD5_2: D5.2(A) R31.1
NetD6_2: D6.2(A) R7.1
NetD7_2: D7.2(A) R6.1
NetD14_1: D14.1(A1) R75.1
NetD14_3: D14.3(C) M1.3(D2) M5.1(GATE)
NetJ4_2: J4.2 R34.1 R36.2 U10.3(EN)
NetL2_1: L2.1 M3.3(SOURCE)
NetM1_2: M1.2(G1) R38.2
NetM1_5: M1.5(G2) R76.2
NetM1_6: M1.6(D1) R36.1
NetR8_1: R8.1 ; port HV_INDICATOR_PWM
NetR24_1: R24.1 R28.2 U4.4(-)
NetR28_1: R28.1 U8.1(K) U8.2(REF)
NetR33_2: R33.2 U9.4(RT/SYNC)
NetR38_1: R38.1 R39.2 ; port USB_3.3v_EN
NetR72_2: R72.2 U14.4(RT/SYNC)
NetR76_1: R76.1 R77.2 ; port 3V3_SW_EN_GPO

### Layout directives
net class ANALOG_SIGNAL: NetC42_1

### Notes on the sheet
- Microcontroller
- High Voltage Converter
- Undervoltage Switchover
- Display Driver
- Power_5v_3v3
- RGB Driver
- LTC-MTC Filtering
- User Control
- ~2.9v
- Operational Note:  If a power supply is plugged, 3.3v_SW_EN is diconnected from ground and pulled high, switching on 3.3v_SW rail.
- If CONV_3V3 rail is less than 2.9v, M4 gate is pulled low and 3.3v rail is switched over to battery power.
- (near C42) Layout Note: Place Cap and diodes near micro input.
- 3.3v Converter
- 5v Converter
- (near TP7) ~3.65v
- (near TP26) ~5.4v
- ~0.75v
- Main 3.3v rail.
  Powered on whenever power is present at VDC
- Main 5v rail.
  Powered on whenever power is present at VDC
- USB Derived 3.3v Rail
- ~3.6v
- Power Rail Indicator Lights
- USB derived 3.3v rail.
  If USB power is present, this LDO provides power to the 3.3v rail.
  Can be switched off by the micro.
- HV On
- (near D6) 5v On
- (near D7) 3.3v On
- (near R9) Layout Note: Place R8 near micro
- 3.3v switched rail for auxilary loads.
  If power is present at VDC, M5 is switched on.
  If USB power is present, M5 is switched on.  LED power is reduced.
  Can be manually shut off by micro.
- (in symbol GST36U12-P1J) GPIO3:  High = Auto Discovery / GPIO6:  High = Bluetooth master / GPIO7:  Low = 115200bps, High = 9600bps /
- (in symbol Testpoint 1.5mm Pad) P
- (in symbol Testpoint Loop) L

### Library data of the parts
BATT1 = 2032 Coin Cell Holder: SMD Coin Cell Holder for CR2032; MFG_PN: SMTU2032-LF.TR; MFG: RENATA; CELL_TYPE: CR2032
C15 C16 = 220uF / 25v: Tolerance: 20%; MFG_PN: EEE-FTE221XAP; MFG: PANASONIC; ESR: 160mohm; LOAD: NL; Value: 220uF
C17 = 10uF 50v (1206): Tolerance: 10%; MFG_PN: C3216X5R1H106K160AB; MFG: TDK; LOAD: NL; Value: 10uF
C18 C47 = 1nF 50v (0402): Tolerance: 10%; MFG_PN: VJ0402Y102KXAAC; MFG: Vishay; LOAD: NL; Value: 1nF
C29 C31 C32 = 0.1uF 50v (0603): as C1 on sheet Microcontroller; Value: 0.1uF
C30 C34 = 10uF 25v (1206): Tolerance: 10%; MFG_PN: GRJ31CR71E106KE11L; MFG: MURATA; LOAD: NL; Value: 10uF
C33 C39 C40 C56 C57 = 22uF 10v (1210): Tolerance: 10%; MFG_PN: GCM32ER71A226ME12L; MFG: MURATA; LOAD: NL; Value: 22uF
C35 C36 C52 C53 = 4.7uF 25v (1206): Tolerance: 10%; MFG_PN: GCM31CR71E475KA55L; MFG: Murata; LOAD: NL; Value: 4.7uF
C37 C41 C45 C54 C58 = 1uF 25v (0805): MFG_PN: VJ0805V105ZXXTW1BC; MFG: Vishay; LOAD: NL; Value: 1uF
C38 C55 = 47nF 50v (0603): Tolerance: 10%; MFG_PN: VJ0603Y473KXACW1BC; MFG: VISHAY; Value: 47nF
C42 = 10nF 25v (0402): as C2 on sheet Microcontroller; Value: 10nF
C43 C59 = 22nF 50v (0603): Tolerance: 5%; MFG1_PN: VJ0603Y223KXACW1BC; MFG1: Vishay; Value: 22nF
C44 C60 = 33pF 50v (0402): as C82 on sheet Microcontroller; Value: 33pF
C46 = 0.1uF 10v (0402): Tolerance: 20%; MFG_PN: VJ0402G104MXQCW1BC; MFG: Vishay; LOAD: NL; Value: 0.1uF
C48 = 2.2uF 25v (1206): MFG1_PN: VJ1206V225ZXXRW1BC; MFG1: Vishay; Value: 2.2uF
C96 C97 = 220pF 25v (0402): Tolerance: 5%; MFG_PN: GRM1555C1E221JA01D; MFG: Murata; LOAD: NL; Value: 220pF
D2 D10-D12 = PMEG3050EP: MFG: NXP; CURRENT: 5A; VF: 0.35v; MFG_PN: PMEG3050EP,115
D3 D30 = PMEG4030ER: MFG: NXP; CURRENT: 3A; VF: 0.54v; MFG_PN: PMEG4030ER,115
D4 = LED Blue 0603: MFG: Lite On; VFORWARD: 2.8v; CURRENT: 20mA; COLOR: Blue; MFG_PN: LTST-C193TBKT-5A
D5 = LED Amber 0603: MFG: Lite On; VFORWARD: 2.1v; CURRENT: 20mA; COLOR: Amber; MFG_PN: LTST-C190AKT
D6 D7 = LED Green 0603: as D1 on sheet Microcontroller; MFG_PN: LTST-S270KGKT
D9 = BAT54S: Series connected dual Schottky diode; MFG: NXP; CONFIG: SERIES DUAL; REV_VOLTAGE: 30v; MFG_PN: BAT54SW,115
D14 = BAS7005WH6327XTSA1: Schottky, Dual, Common Cathode; MFG: Vishay; Value: *; CONFIGURATION: COMMON CATHODE; MFG_PN: BAS7005WH6327XTSA1
FB1 FB2 = BLM21PG331SH1D (0805): as FB3 on sheet Microcontroller; MFG_PN: BLM21PG331SH1D
J2 = PJ-002AH-SMT-TR: 2.0mm ID/6.5mm OD Barrel Plug; MFG: CUI; VOLTAGE: 16v; CURRENT: 5A; MFG_PN: PJ-002AH-SMT-TR
J4 = Jumper x1: Jumper_Single_2.54mm
L2 L4 = EMI Ferrite (0805): MFG: MURATA; MFG_PN: BLM21PG300SN1D; CURRENT: 3A; LOAD: NL; TOLERANCE: 20%; IMPEDANCE: 30 ohm
L3 L5 = 10uH 3.3A: Inductor, 10uH, 3.3A; MFG: LAIRD; RES: 29mOhm; ISAT: 3.6A; MFG_PN: TYS8040100M-10; VALUE: 10uH
M1 = NX3020NAKV: NFET_DUAL_200mA_30v; LOAD: NL; MFG: NXP; VDS_MAX: 30v; I_MAX: 200mA; P_MAX: 1.1W; RDS_ON: 2.7; VGS_MAX: *; MFG_PN: NX3020NAKV,115
M3 = IPD90P04P4L-04: PFET_SINGLE_90A_40v; LOAD: NL; MFG: INFINEON; VDS_MAX: -40v; I_MAX: 90A; VGS_MAX: 16v; P_MAX: 125W; RDS_ON: 4.3m; VGS_TH: -2.2v; Q_GATE: 176nC; MFG_PN: IPD90P04P4L-04
M4 = DMP3056L: PFET_SINGLE_4.3A_30v; LOAD: NL; MFG: DIODES_INC; VDS_MAX: -30v; I_MAX: -4.3A; VGS_MAX: 25v; P_MAX: 1.38W; RDS_ON: 35m; VGS_TH: -1v; MFG_PN: DMP3056L-7
M5 = Si2338DS: NFET_SINGLE_6A_30V; LOAD: NL; MFG: VISHAY; VDS_MAX: 30v; I_MAX: 6A; VGS_MAX: 20v; RDS_ON: 23m; Q_GATE: 8.2nC; P_MAX: *; MFG_PN: Si2338DS-T1-GE3
M16 = 2N7002: NFET_SINGLE_360mA_60V; LOAD: NL; MFG: NXP; VDS_MAX: 60v; I_MAX: 360mA; VGS_MAX: 20v; P_MAX: *; RDS_ON: *; MFG_PN: 2N7002P,215
R5 R6 = 47R (0603): Tolerance: 1%; POWER: 0.1W; Load: NL; MFG_PN: CRCW060347R0FKEA; MFG: Vishay; Value: 47R
R7 = 150R (0603): Tolerance: 1%; POWER: 0.1W; Load: NL; MFG_PN: CRCW0603150RFKEA; MFG: Vishay; Value: 150R
R8 = 100R (0402): Tolerance: 1%; POWER: 63mW; Load: NL; MFG_PN: CRCW0402100RFKED; MFG: Vishay; Value: 100R
R9 = 10k (0402): Tolerance: 1%; POWER: 63mW; Load: NL; MFG_PN: CRCW040210K0FKED; MFG: Vishay; Value: 10k
R23 R33 R34 R72 = 49.9k (0402): Tolerance: 1%; POWER: 63mW; MFG_PN: CRCW040249K9FKED; MFG: Vishay; Load: NL; Value: 49.9k
R24 R28 R38 R76 = 100R (0402): as R4 on sheet Microcontroller; Value: 100R
R25 = 0R (1206): 0R, 1206; MFG_PN: CRCW12060000Z0EA; MFG: Vishay; Value: 0R
R26 R70 = 20R (0402): Tolerance: 1%; POWER: 63mW; MFG_PN: CRCW040220R0FKED; MFG: Vishay; Load: NL; Value: 20R
R27 = 200k   0.1% (0402): POWER: 63mW; MFG_PN: MCS04020D2003BE100; MFG: Vishay; Load: NL; Value: 200k
R29 = 0R (1206): 0R, 1206; MFG_PN: CRCW12060000Z0EA; MFG: Vishay; Load: NL; Value: 0R
R30 R74 = 80.6k (0402): Tolerance: 1%; POWER: 63mW; MFG_PN: CRCW040280K6FKED; MFG: Vishay; Load: NL; Value: 80.6k
R31 = 470R (0603): Tolerance: 1%; POWER: 0.1W; MFG_PN: CRCW0603470RFKEA; MFG: Vishay; Load: NL; Value: 470R
R32 = 36k   0.1% (0402): POWER: 63mW; MFG_PN: TNPW040236K0BEED; MFG: Vishay; Load: NL; Value: 36k
R35 = 470k (0402): Tolerance: 1%; POWER: 63mW; MFG_PN: CRCW0402470KFKED; MFG: Vishay; Load: NL; Value: 470k
R36 = 1k (0402): as R86 on sheet Microcontroller; Value: 1k
R37 = 150k (0402): Tolerance: 1%; POWER: 63mW; MFG_PN: CRCW0402150KFKED; MFG: Vishay; Load: NL; Value: 150k
R39 R75 R77 = 10k (0402): as R2 on sheet Microcontroller; Value: 10k
R71 = 316k (0402): Tolerance: 1%; POWER: 63mW; MFG_PN: CRCW0402316KFKED; MFG: Vishay; Load: NL; Value: 316k
R73 = 499k (0402): Tolerance: 1%; POWER: 63mW; MFG_PN: CRCW0402499KFKED; MFG: Vishay; Load: NL; Value: 499k
R162 R163 = 10R (0402): Tolerance: 1%; POWER: 63mW; MFG_PN: CRCW040210R0FKED; MFG: Vishay; Load: NL; Value: 10R
R164 R165 = 3R (0603): Tolerance: 1%; POWER: 0.1W; MFG_PN: CRCW06033R00FKEA; MFG: Vishay; Load: NL; Value: 3R
T1 = GST36U12-P1J: 12v/3A Wall Mount AC Adapter; PLUG_TYPE: 2.1mm Barrel Plug; MFG_PN: GST36U12-P1J
TP4 TP5 TP7 TP8 TP24 TP26 TP27 = Testpoint Loop: MFG: KEYSTONE; MFG_PN: 5001
TP6 TP9-TP11 TP21-TP23 TP25 TP28-TP31 = Testpoint 1.5mm Pad: 1.5mm Testpoint
U4 = TLV3201AIDBVR: High Speed Analog Comparator; LOAD: NL; MFG: TI; OUTPUT_TYPE: PUSH-PULL; RESPONSE_TIME: 47ns; MFG_PN: TLV3201AIDBVR
U8 = TL431: Voltage Reference; MFG: TI; MFG_PN: TL431BCDBZR
U9 U14 = LMR14020SDDAR: Buck Regulator, Adjustable, 2A; MFG: TI; VOUT: 0.8-24v; MFG_PN: LMR14020SDDAR; IOUT: 2A
U10 = TPS73401DDCT: TPS73401DDCT, LDO, 250mA, Adj; MFG: TI; MFG_PN: TPS73401DDCT; CURRENT: 250mA; VOUT: Adj

## Sheet High Voltage Converter.SchDoc
size C
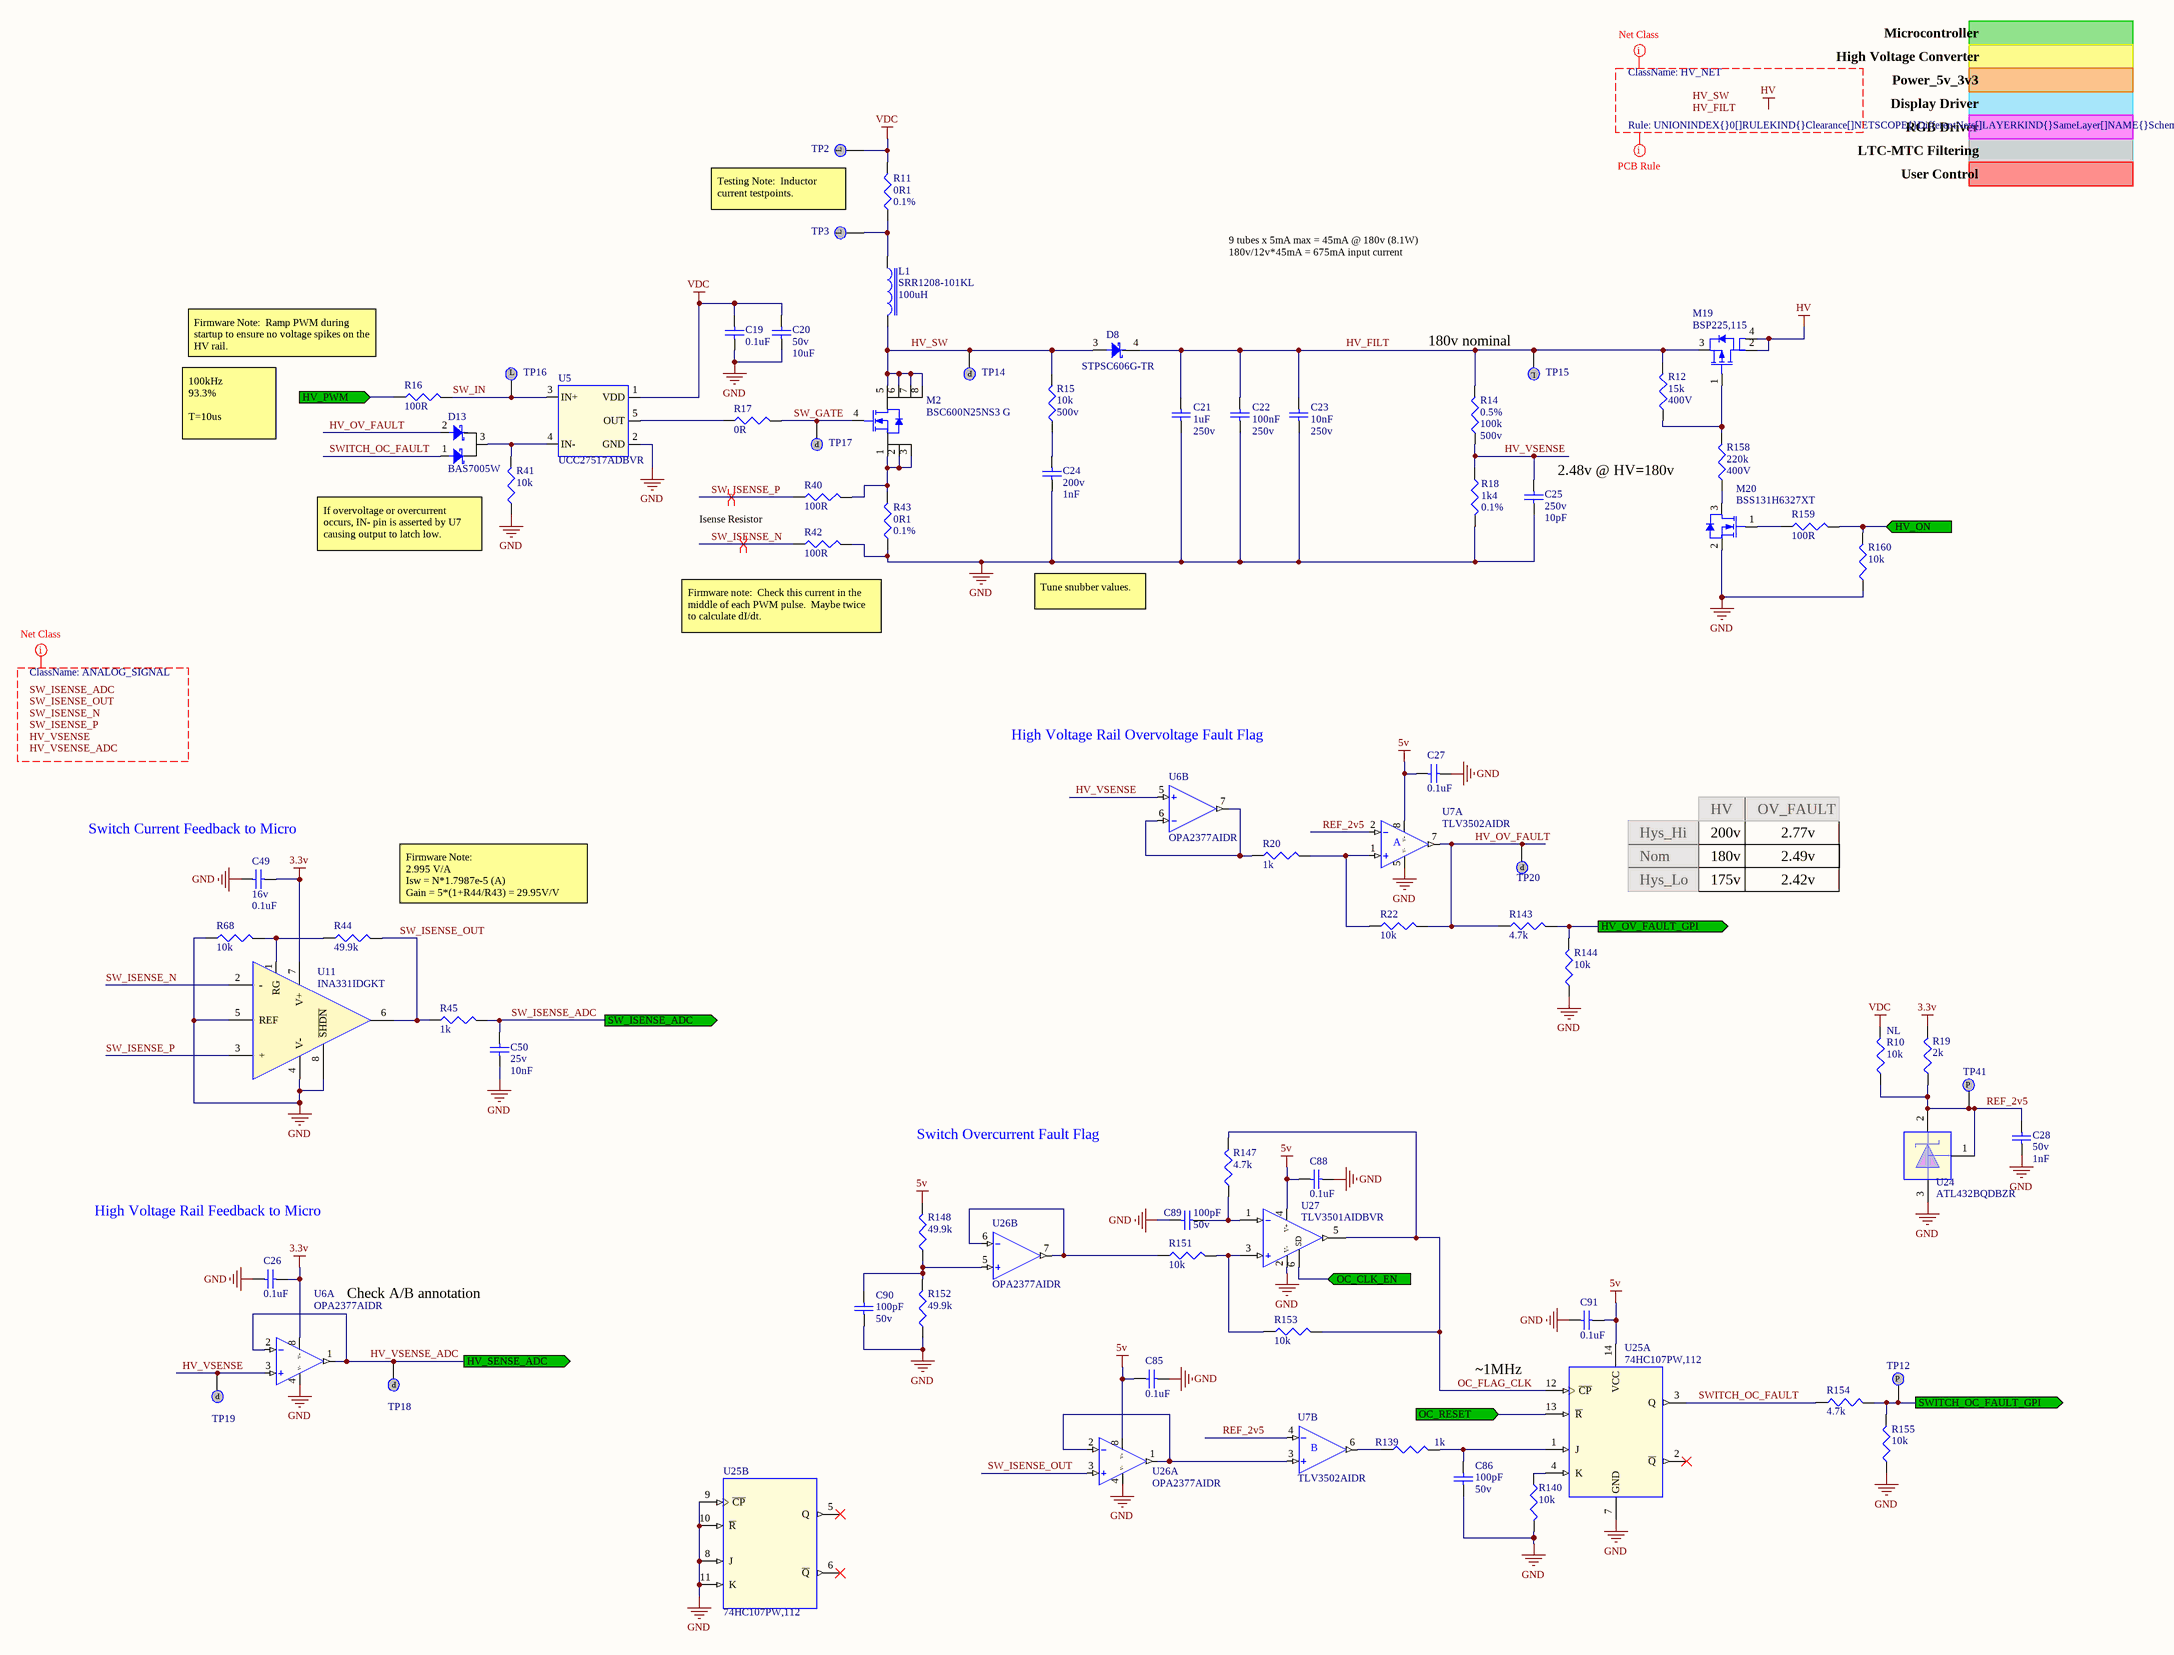
[diagram p7: High Voltage Converter.SchDoc]

### Parts
C19  0.1uF  [CAP0603R]
C20  Voltage: 50v  [CAP1206R]  (hidden comment: 10uF)
C21  Voltage: 250v  [CAP2220R]  (hidden comment: 1uF)
C22  Voltage: 250v  [CAP1206R]  (hidden comment: 100nF)
C23  Voltage: 250v  [CAP0805R]  (hidden comment: 10nF)
C24  Voltage: 200v  [CAP0805R]  (hidden comment: 1nF)
C25  Voltage: 250v  [CAP0805R]  (hidden comment: 10pF)
C26  0.1uF  [CAP0402R]
C27  0.1uF  [CAP0402R]
C28  Voltage: 50v  [CAP0402R]  (hidden comment: 1nF)
C49  Voltage: 16v  [CAP0603R]  (hidden comment: 0.1uF)
C50  Voltage: 25v  [CAP0402R]  (hidden comment: 10nF)
C85  0.1uF  [CAP0402R]
C86  Voltage: 50v  [CAP0402R]  (hidden comment: 100pF)
C88  0.1uF  [CAP0402R]
C89  Voltage: 50v  [CAP0402R]  (hidden comment: 100pF)
C90  Voltage: 50v  [CAP0402R]  (hidden comment: 100pF)
C91  0.1uF  [CAP0402R]
D8  STPSC606G-TR  [D2PAK-3]
D13  BAS7005W  [SOT-323]
L1  MFG_PN: SRR1208-101KL  [SRR1208]  (hidden comment: 100uH)
M2  BSC600N25NS3 G  [PowerPAK-SO8]
M19  BSP225,115  [SOT223]
M20  BSS131H6327XT  [SOT23-3 REFLOW]
R10  Load: NL  [RES0402R]  (hidden comment: 10k)
R11  Tolerance: 0.1%  [RES1206R]  (hidden comment: 0R1)
R12  VOLTAGE: 400V  [RES2010R]  (hidden comment: 15k)
R14  Tolerance: 0.5%  VOLTAGE: 500v  [RES1206R]  (hidden comment: 100k)
R15  VOLTAGE: 500v  [RES1206R]  (hidden comment: 10k)
R16  100R  [RES0402R]
R17  0R  [RES0603R]
R18  Tolerance: 0.1%  [RES0603R]  (hidden comment: 1k4)
R19  2k  [RES0402R]
R20  1k  [RES0402R]
R22  10k  [RES0402R]
R40  100R  [RES0402R]
R41  10k  [RES0402R]
R42  100R  [RES0402R]
R43  Tolerance: 0.1%  [RES1206R]  (hidden comment: 0R1)
R44  49.9k  [RES0402R]
R45  1k  [RES0402R]
R68  10k  [RES0402R]
R139  1k  [RES0402R]
R140  10k  [RES0402R]
R143  4.7k  [RES0402R]
R144  10k  [RES0402R]
R147  4.7k  [RES0402R]
R148  49.9k  [RES0402R]
R151  10k  [RES0402R]
R152  49.9k  [RES0402R]
R153  10k  [RES0402R]
R154  4.7k  [RES0402R]
R155  10k  [RES0402R]
R158  VOLTAGE: 400V  [RES2010R]  (hidden comment: 220k)
R159  100R  [RES0402R]
R160  10k  [RES0402R]
TP2  5001  [5001 Testpoint]  (value not drawn)
TP3  5001  [5001 Testpoint]  (value not drawn)
TP12  NONE  [TESTPOINT - 1.5mm Round Pad]  (value not drawn)
TP14  NONE  [TESTPOINT - 1.5mm Round Pad]  (value not drawn)
TP15  5001  [5001 Testpoint]  (value not drawn)
TP16  5001  [5001 Testpoint]  (value not drawn)
TP17  NONE  [TESTPOINT - 1.5mm Round Pad]  (value not drawn)
TP18  NONE  [TESTPOINT - 1.5mm Round Pad]  (value not drawn)
TP19  NONE  [TESTPOINT - 1.5mm Round Pad]  (value not drawn)
TP20  NONE  [TESTPOINT - 1.5mm Round Pad]  (value not drawn)
TP41  NONE  [TESTPOINT - 1.5mm Round Pad]  (value not drawn)
U5  UCC27517ADBVR  [SOT23-5]
U6  OPA2377AIDR  [SOIC-8]  (parts A,B of 2)
U7  TLV3502AIDR  [SOIC-8]  (parts A,B of 2)
U11  INA331IDGKT  [VSSOP8]
U24  ATL432BQDBZR  [SOT23-3M]
U25  74HC107PW,112  [TSSOP14]  (parts A,B of 2)
U26  OPA2377AIDR  [SOIC-8]  (parts A,B of 2)
U27  TLV3501AIDBVR  [SOT23-6]

### Ports
HV_ON (in), HV_OV_FAULT_GPI (out), HV_PWM (in), HV_SENSE_ADC (out), OC_CLK_EN (in), OC_RESET (in), SW_ISENSE_ADC (out), SWITCH_OC_FAULT_GPI (out)

### Nets
3.3v: C26.2 C49.2 R19.2 U6.8(V+) U11.7(V+)
5v: C27.2 C85.2 C88.2 C91.2 R148.2 U7.8(V+) U25.14(VCC) U26.8(V+) U27.4(V+)
GND: C19.2 C20.1 C21.2 C22.2 C23.2 C24.2 C25.2 C26.1 C27.1 C28.2 C49.1 C50.2 C85.1 C86.2 C88.1 C89.1 C90.2 C91.1 M20.2(SOURCE) R18.2 R41.1 R42.2 R43.1 R68.1 R140.2 R144.1 R152.1 R155.1 R160.1 U5.2(GND) U6.4(V-) U7.5(V-) U11.4(V-) U11.5(REF) U11.8(~{SHDN}) U24.3(A) U25.7(GND) U25.8(J) U25.9(~{CP}) U25.10(~{R}) U25.11(K) U26.4(V-) U27.2(V-)
HV: M19.2(DRAIN) M19.4(DRAIN)
VDC: C19.1 C20.2 R10.2 R11.2 TP2.1 U5.1(VDD)
HV_FILT: C21.1 C22.1 C23.1 D8.4 M19.3(SOURCE) R12.2 R14.2 TP15.1
HV_OV_FAULT: D13.2(A2) R22.2 R143.1 TP20.1 U7.7(OUT_A)
HV_SW: D8.3(A) L1.2 M2.5(DRAIN) M2.6(DRAIN) M2.7(DRAIN) M2.8(DRAIN) R15.2 TP14.1
HV_VSENSE: C25.1 R14.1 R18.1 TP19.1 U6.3(+IN_A) U6.5(+IN_B)
HV_VSENSE_ADC: TP18.1 U6.1(OUT_A) U6.2(-IN_A) ; port HV_SENSE_ADC
OC_FLAG_CLK: R147.2 R153.2 U25.12(~{CP}) U27.5(OUT_A)
REF_2v5: C28.1 R10.1 R19.1 TP41.1 U7.2(-IN_A) U7.4(-IN_A) U24.1(REF) U24.2(K)
SW_GATE: M2.4(GATE) R17.2 TP17.1
SW_IN: R16.2 TP16.1 U5.3(IN+)
SW_ISENSE_ADC: C50.1 R45.2 ; port SW_ISENSE_ADC
SW_ISENSE_N: R42.1 U11.2(-)
SW_ISENSE_OUT: R44.2 R45.1 U11.6(OUT) U26.3(+IN_A)
SW_ISENSE_P: R40.1 U11.3(+)
SWITCH_OC_FAULT: D13.1(A1) R154.1 U25.3(Q)
NetC24_1: C24.1 R15.1
NetC86_1: C86.1 R139.2 U25.1(J)
NetC89_2: C89.2 R147.1 U27.1(-IN_A)
NetC90_1: C90.1 R148.1 R152.2 U26.5(+IN_B)
NetD13_3: D13.3(C) R41.2 U5.4(IN-)
NetL1_1: L1.1 R11.1 TP3.1
NetM2_1: M2.1(SOURCE) M2.2(SOURCE) M2.3(SOURCE) R40.2 R43.2
NetM19_1: M19.1(GATE) R12.1 R158.2
NetM20_1: M20.1(GATE) R159.1
NetM20_3: M20.3(DRAIN) R158.1
NetR16_1: R16.1 ; port HV_PWM
NetR17_1: R17.1 U5.5(OUT)
NetR20_1: R20.1 U6.6(-IN_B) U6.7(OUT_B)
NetR20_2: R20.2 R22.1 U7.1(+IN_A)
NetR44_1: R44.1 R68.2 U11.1(RG)
NetR82_2: U27.6(SD) ; port OC_CLK_EN
NetR106_2: U25.13(~{R}) ; port OC_RESET
NetR139_1: R139.1 U7.6(OUT_A)
NetR140_1: R140.1 U25.4(K)
NetR143_2: R143.2 R144.2 ; port HV_OV_FAULT_GPI
NetR151_1: R151.1 U26.6(-IN_B) U26.7(OUT_B)
NetR151_2: R151.2 R153.1 U27.3(+IN_A)
NetR154_2: R154.2 R155.2 TP12.1 ; port SWITCH_OC_FAULT_GPI
NetR159_2: R159.2 R160.2 ; port HV_ON
NetU7_3: U7.3(+IN_A) U26.1(OUT_A) U26.2(-IN_A)

Not connected (* = marked no-connect by the designer): U25 2(~{Q})* 5(Q)* 6(~{Q})*

### Layout directives
differential pair: SW_ISENSE_N, SW_ISENSE_P
net class HV_NET: HV, HV_FILT, HV_SW
rule Clearance Constraint [Clearance = 10mil]: HV, HV_FILT, HV_SW
net class ANALOG_SIGNAL: HV_VSENSE, HV_VSENSE_ADC, SW_ISENSE_ADC, SW_ISENSE_N, SW_ISENSE_OUT, SW_ISENSE_P

### Notes on the sheet
- Microcontroller
- High Voltage Converter
- Power_5v_3v3
- Display Driver
- RGB Driver
- LTC-MTC Filtering
- Testing Note:  Inductor current testpoints.
- User Control
- 9 tubes x 5mA max = 45mA @ 180v (8.1W)
  180v/12v*45mA = 675mA input current
- Firmware Note:  Ramp PWM during startup to ensure no voltage spikes on the HV rail.
- (near TP15) 180v nominal
- 100kHz
  93.3%
  T=10us
- (near C25) 2.48v @ HV=180v
- If overvoltage or overcurrent occurs, IN- pin is asserted by U7 causing output to latch low.
- Isense Resistor
- Tune snubber values.
- Firmware note:  Check this current in the middle of each PWM pulse.  Maybe twice to calculate dI/dt.
- High Voltage Rail Overvoltage Fault Flag
- (near C49) Switch Current Feedback to Micro
- Nom
- Hys_Hi
- 180v
- 200v
- HV
- OV_FAULT
- 2.49v
- 2.77v
- (near R44) Firmware Note:
  2.995 V/A
  Isw = N*1.7987e-5 (A)
  Gain = 5*(1+R44/R43) = 29.95V/V
- Hys_Lo
- 175v
- 2.42v
- Switch Overcurrent Fault Flag
- High Voltage Rail Feedback to Micro
- Check A/B annotation
- ~1MHz
- Labels drawn without touching a wire or pin: HV, HV_FILT, HV_SW, HV_VSENSE, HV_VSENSE_ADC, SW_ISENSE_ADC, SW_ISENSE_N, SW_ISENSE_OUT, SW_ISENSE_P
- (in symbol Testpoint 1.5mm Pad) P
- (in symbol Testpoint Loop) L
- (in symbol TLV3502AIDR, part A) A
- (in symbol TLV3502AIDR, part B) B

### Library data of the parts
C19 = 0.1uF 50v (0603): MFG_PN: VJ0603V104ZXAPW1BC; MFG: Vishay; Voltage: 50v; LOAD: NL; Value: 0.1uF
C20 = 10uF 50v (1206): as C17 on sheet Power_5v_3v3; Value: 10uF
C21 = 1uF 250v (2220): Tolerance: 10%; MFG_PN: GRM55DR72E105KW01L; MFG: Murata; LOAD: NL; Value: 1uF
C22 = 100nF 250v (1206): Tolerance: 10%; MFG_PN: GRM31CR72E104KW03L; MFG: Murata; LOAD: NL; Value: 100nF
C23 = 10nF 250v (0805): Tolerance: 10%; MFG_PN: GRM21BR72E103KW03L; MFG: Murata; LOAD: NL; Value: 10nF
C24 = 1nF 200v (0805): MFG_PN: VJ0805Y102KXCAC; MFG: Vishay; LOAD: NL; Value: 1nF
C25 = 10pF 250V (0805): Tolerance: 5%; MFG_PN: GQM2195C2E100JB12D; MFG: Murata; LOAD: NL; Value: 10pF
C26 C27 C85 C88 C91 = 0.1uF 10v (0402): Tolerance: 20%; MFG_PN: VJ0402G104MXQCW1BC; MFG: Vishay; Voltage: 10v; LOAD: NL; Value: 0.1uF
C28 = 1nF 50v (0402): as C18 on sheet Power_5v_3v3; Value: 1nF
C49 = 0.1uF 16v (0603): as C9 on sheet Microcontroller; Value: 0.1uF
C50 = 10nF 25v (0402): as C2 on sheet Microcontroller; Value: 10nF
C86 C89 C90 = 100pF 50v (0402): Tolerance: 10%; MFG_PN: GCM1555C1H101JA16D; MFG: MURATA; LOAD: NL; Value: 100pF
D8 = STPSC606G-TR: Schottky, 6A, 600v; MFG: STMICRO; MFG_PN: STPSC606G-TR; CURRENT: 6A; VREV: 600v
D13 = BAS7005WH6327XTSA1: Schottky, Dual, Common Cathode; MFG: Vishay; IFORWARD: 70mA; VFORWARD: 880mV; Value: *; CONFIGURATION: COMMON CATHODE; MFG_PN: BAS7005WH6327XTSA1
L1 = 100uH_SRR1208: MFG: Bourns; CURRENT: 1.5A; RESISTANCE: 170u; ISAT: 2.1A; Value: 100uH
M2 = BSC600N25NS3 G: NFET_SINGLE_25A_250V; LOAD: NL; MFG: Infineon; VDS_MAX: 250v; I_MAX: 2.3A; VGS_MAX: 20v; GATE_CHARGE: 10nC; MFG_PN: BSC600N25NS3 G
M19 = BSP225,115: PFET_SINGLE_0.225A_1.5W_250V; LOAD: NL; MFG: NXP; VDS_MAX: -250V; I_MAX: 225mA; VGS_MAX: 20V; P_MAX: 50W; RDS_ON: 10R; MFG_PN: BSP225,115
M20 = BSS131H6327XT: NFET_SINGLE_100mA_240v; MFG: INFINEON; VDS: 240v; VGS: 20v; RDS: 14R; CURRENT: 0.1A; MFG_PN: BSS131H6327XT
R10 = 10k (0402): Tolerance: 1%; POWER: 63mW; MFG_PN: CRCW040210K0FKED; MFG: Vishay; Value: 10k
R11 R43 = 100m 0.1% (1206): POWER: 1W; MFG_PN: WSL1206R1000DEA; MFG: Vishay; Load: NL; Value: 0R1
R12 = 15k 400v (2010): Tolerance: 1%; POWER: 0.750mW; MFG_PN: CRCW201015K0FKEF; MFG: VISHAY; Load: NL; Value: 15k
R14 = 100k 500v (1206): POWER: 0.25mW; MFG_PN: HV732BTTD1003D; MFG: KOA SPEER; Load: NL; Value: 100k
R15 = 10k 500v (1206): Tolerance: 5%; POWER: 0.66mW; MFG_PN: ERJ-P08J103V; MFG: Panasonic; Load: NL; Value: 10k
R16 R40 R42 R159 = 100R (0402): as R4 on sheet Microcontroller; Value: 100R
R17 = 0R (0603): MFG_PN: CRCW12060000Z0EA; MFG: Vishay; Load: NL; Value: 0R
R18 = 1k4   0.1%: POWER: 0.1W; MFG1_PN: TNPW06031K40BEEA; MFG1: Vishay; Load: NL; Value: 1k4
R19 = 2k (0402): as R149 on sheet Microcontroller; Value: 2k
R20 R45 R139 = 1k (0402): as R86 on sheet Microcontroller; Value: 1k
R22 R41 R68 R140 R144 R151 R153 R155 R160 = 10k (0402): as R2 on sheet Microcontroller; Value: 10k
R44 R148 R152 = 49.9k (0402): as R23 on sheet Power_5v_3v3; Value: 49.9k
R143 R147 R154 = 4.7k (0402): Tolerance: 1%; POWER: 63mW; MFG_PN: CRCW04024K70FKED; MFG: Vishay; Load: NL; Value: 4.7k
R158 = 220k 400v (2010): Tolerance: 1%; POWER: 0.750mW; MFG_PN: CRCW2010220KFKEF; MFG: VISHAY; Load: NL; Value: 220k
TP2 TP3 TP15 TP16 = Testpoint Loop: MFG: KEYSTONE; MFG_PN: 5001
TP12 TP14 TP17-TP20 TP41 = Testpoint 1.5mm Pad: 1.5mm Testpoint
U5 = UCC27517ADBVR: Low Side Gate Driver; MFG: TI; VMAX: 18v; ISOURCE: 4A; LOAD: NL; MFG_PN: UCC27517ADBVR; ISINK: 4A
U6 U26 = OPA2377AIDR: OpAmp - 2 Channel; LOAD: NL; MFG: TI; CHANNELS: 2; GBP: 5MHz; SINGLE_SUPPLY: TRUE; VMAX: 5.5v; OFFSET_VOLTAGE: 1mV; MFG_PN: OPA2377AIDR
U7 = TLV3502AIDR: Comparator, Dual, High Speed; LOAD: NL; MFG: TI; VMIN: 2.2v; VMAX: 5.5v; VOFFSET: 6.5mV; RESPONSE_TIME: 4.5ns; MFG_PN: TLV3502AIDR
U11 = INA331IDGKT: Instrumentation Amplifier - 1 Channel; MFG: TI; LOAD: NL; GBP: 2MHz; VMAX: 5.5v; SINGLE_SUPPLY: TRUE; VOFFSET: 500uV; MFG_PN: INA331IDGKT
U24 = ATL432BQDBZR: as U3 on sheet Microcontroller; MFG_PN: ATL432BQDBZR
U25 = 74HC107D,653: Dual JK Flip Flop, Neg Edge Triggered; MFG: NXP; CHANNELS: 2; VMIN: 2v; VMAX: 6v; MFG_PN: 74HC107PW,112
U27 = TLV3501AIDBVR: Comparator, Single, High Speed; LOAD: NL; MFG: TI; VMIN: 2.2v; VMAX: 5.5v; VOFFSET: 6.5mV; RESPONSE_TIME: 4.5ns; MFG_PN: TLV3501AIDBVR